# Altium project Trepanat.PrjPcb
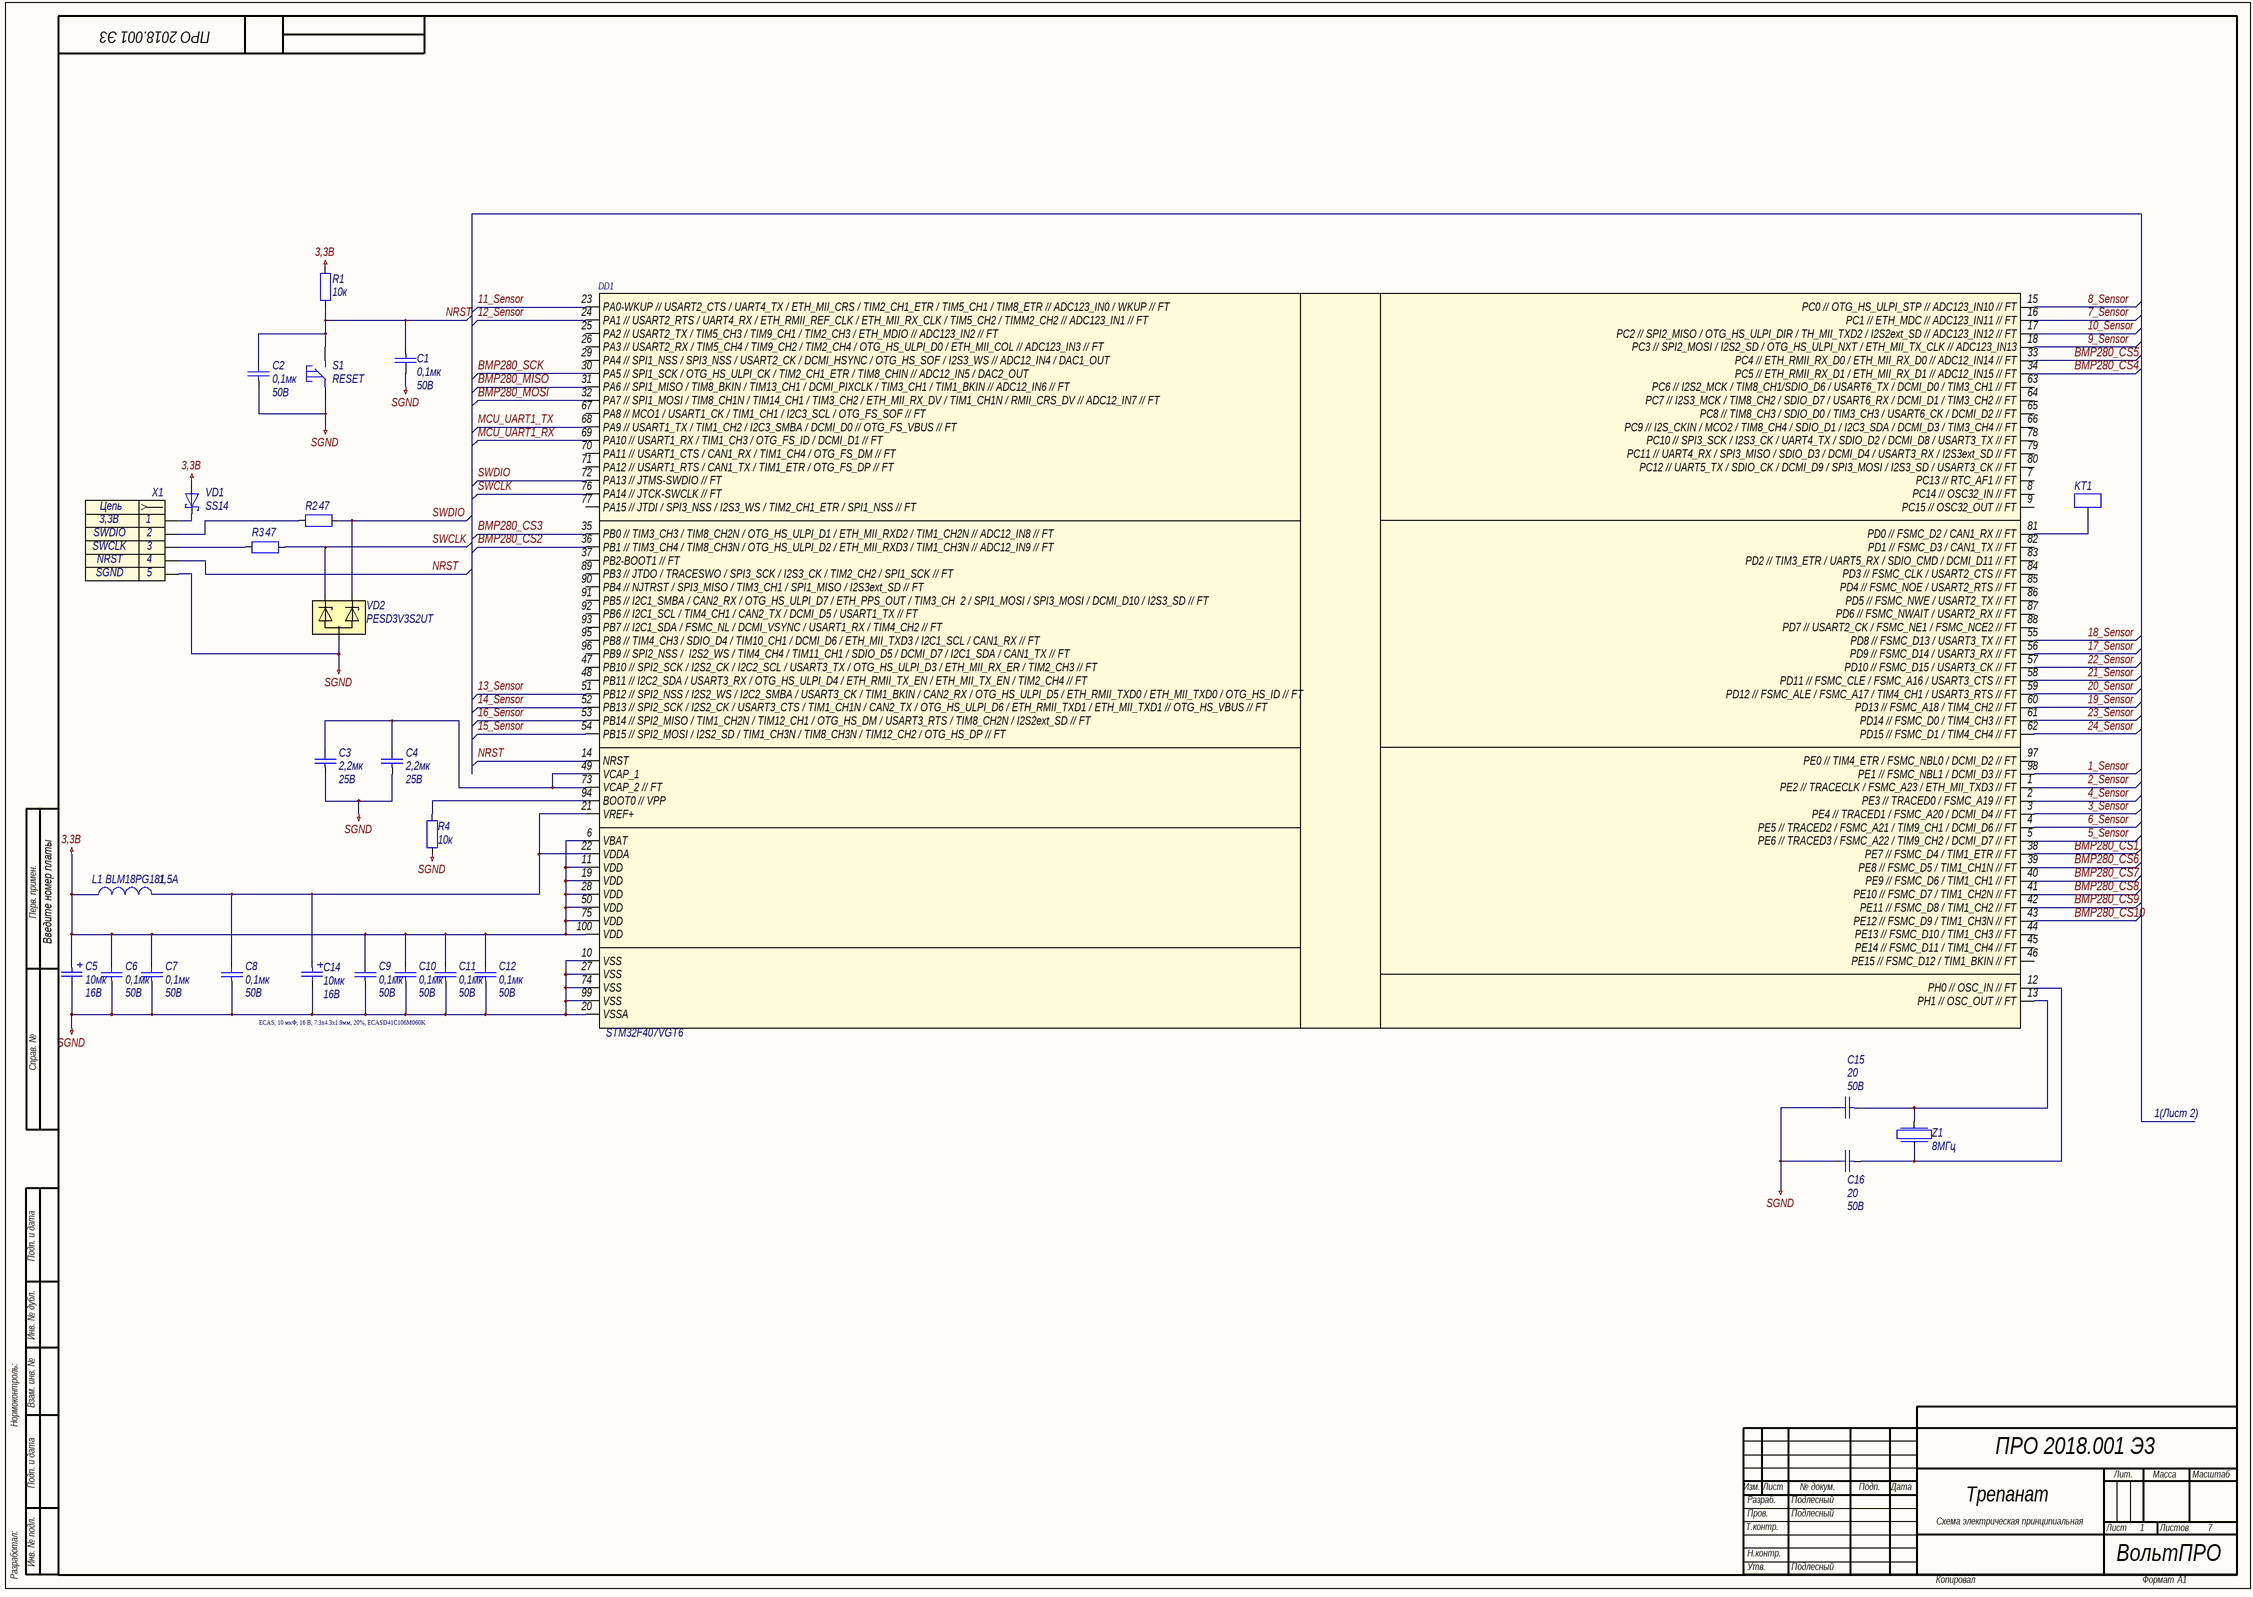
[diagram p0: Trepanat_MCU.SchDoc]
7 sheets, 354 parts. Net scope: global (net labels, ports and power ports of the same name join across sheets).
Board file: Trepanat.PcbDoc
Sheets:
  Trepanat_MCU.SchDoc
  Trepanat_Output.SchDoc
  Trepanat_Power.SchDoc
  Trepanat_Pressure.SchDoc
  Trepanat_Sensors_1.SchDoc
  Trepanat_Sensors_2.SchDoc
  Trepanat_Sensors_3.SchDoc

## Sheet Trepanat_MCU.SchDoc: Трепанат
size 840 x 594 mm; ApprovedBy: Подлесный; CheckedBy: Подлесный; CompanyName: ВольтПРО; DrawnBy: Подлесный; DocumentNumber: ПРО 2018.001 Э3; SheetNumber: 1; SheetTotal: 7; DocumentType: Схема электрическая принципиальная; Format: A1; ImagePath: Введите номер платы

### Parts
C1  0,1мк  Voltage: 50В  [C0805]
C2  0,1мк  Voltage: 50В  [C0805]
C3  2,2мк  Voltage: 25В  [C0805]
C4  2,2мк  Voltage: 25В  [C0805]
C5  Voltage: 16В  [TANTAL CASE D]  (hidden comment: 10мк)
C6  0,1мк  Voltage: 50В  [C0805]
C7  0,1мк  Voltage: 50В  [C0805]
C8  0,1мк  Voltage: 50В  [C0805]
C9  0,1мк  Voltage: 50В  [C0805]
C10  0,1мк  Voltage: 50В  [C0805]
C11  0,1мк  Voltage: 50В  [C0805]
C12  0,1мк  Voltage: 50В  [C0805]
C14  Voltage: 16В  [TANTAL CASE D]  (hidden comment: 10мк)
C15  20  Voltage: 50В  [C0805]
C16  Voltage: 50В  [C0805]  (hidden comment: 20)
DD1  (no value)  [LQPF100]
KT1  KT  [КТ]  (value not drawn)
L1  BLM18PG181  Imax: 1,5A  [L0603]
R1  10к  [R0805]
R2  47  [R0805]
R3  47  [R0805]
R4  10к  [R0805]
S1  RESET  [Button_SMD]
VD1  SS14  [SMA]
VD2  PESD3V3S2UT  [SOT23-3]
X1  (no value)  [PLS-5]
Z1  8МГц  [QSMD5.0x3.2x1.0]

### Nets
3,3B: C5.1 C6.2 C7.2 C9.2 C10.2 C11.2 C12.2 DD1.6(VBAT) DD1.11(VDD) DD1.19(VDD) DD1.28(VDD) DD1.50(VDD) DD1.75(VDD) DD1.100(VDD) L1.1 R1.2 VD1.2(A)
SGND: C1.2 C2.1 C3.1 C4.1 C5.2 C6.1 C7.1 C8.1 C9.1 C10.1 C11.1 C12.1 C14.2 C15.2 C16.2 DD1.10(VSS) DD1.20(VSSA) DD1.27(VSS) DD1.74(VSS) DD1.99(VSS) R4.2 S1.1 VD2.3 X1.5
1_Sensor: DD1.98(PE1_//_FSMC_NBL1_/_DCMI_D3_//_FT)
2_Sensor: DD1.1(PE2_//_TRACECLK_/_FSMC_A23_/_ETH_MII_TXD3_//_FT)
3_Sensor: DD1.3(PE4_//_TRACED1_/_FSMC_A20_/_DCMI_D4_//_FT)
4_Sensor: DD1.2(PE3_//_TRACED0_/_FSMC_A19_//_FT)
5_Sensor: DD1.5(PE6_//_TRACED3_/_FSMC_A22_/_TIM9_CH2_/_DCMI_D7_//_FT)
6_Sensor: DD1.4(PE5_//_TRACED2_/_FSMC_A21_/_TIM9_CH1_/_DCMI_D6_//_FT)
7_Sensor: DD1.16(PC1_//_ETH_MDC_//_ADC123_IN11_//_FT)
8_Sensor: DD1.15(PC0_//_OTG_HS_ULPI_STP_//_ADC123_IN10_//_FT)
9_Sensor: DD1.18(PC3_//_SPI2_MOSI_/_I2S2_SD_/_OTG_HS_ULPI_NXT_/_ETH_MII_TX_CLK_//_ADC123_IN13)
10_Sensor: DD1.17(PC2_//_SPI2_MISO_/_OTG_HS_ULPI_DIR_/_TH_MII_TXD2_/_I2S2ext_SD_//_ADC123_IN12_//_FT)
11_Sensor: DD1.23(PA0-WKUP_//_USART2_CTS_/_UART4_TX_/_ETH_MII_CRS_/_TIM2_CH1_ETR_/_TIM5_CH1_/_TIM8_ETR_//_ADC123_IN0_/_WKUP_//_FT)
12_Sensor: DD1.24(PA1_//_USART2_RTS_/_UART4_RX_/_ETH_RMII_REF_CLK_/_ETH_MII_RX_CLK_/_TIM5_CH2_/_TIMM2_CH2_//_ADC123_IN1_//_FT)
13_Sensor: DD1.51(PB12_//_SPI2_NSS_/_I2S2_WS_/_I2C2_SMBA_/_USART3_CK_/_TIM1_BKIN_/_CAN2_RX_/_OTG_HS_ULPI_D5_/_ETH_RMII_TXD0_/_ETH_MII_TXD0_/_OTG_HS_ID_//_FT)
14_Sensor: DD1.52(PB13_//_SPI2_SCK_/_I2S2_CK_/_USART3_CTS_/_TIM1_CH1N_/_CAN2_TX_/_OTG_HS_ULPI_D6_/_ETH_RMII_TXD1_/_ETH_MII_TXD1_//_OTG_HS_VBUS_//_FT)
15_Sensor: DD1.54(PB15_//_SPI2_MOSI_/_I2S2_SD_/_TIM1_CH3N_/_TIM8_CH3N_/_TIM12_CH2_/_OTG_HS_DP_//_FT)
16_Sensor: DD1.53(PB14_//_SPI2_MISO_/_TIM1_CH2N_/_TIM12_CH1_/_OTG_HS_DM_/_USART3_RTS_/_TIM8_CH2N_/_I2S2ext_SD_//_FT)
17_Sensor: DD1.56(PD9_//_FSMC_D14_/_USART3_RX_//_FT)
18_Sensor: DD1.55(PD8_//_FSMC_D13_/_USART3_TX_//_FT)
19_Sensor: DD1.60(PD13_//_FSMC_A18_/_TIM4_CH2_//_FT)
20_Sensor: DD1.59(PD12_//_FSMC_ALE_/_FSMC_A17_/_TIM4_CH1_/_USART3_RTS_//_FT)
21_Sensor: DD1.58(PD11_//_FSMC_CLE_/_FSMC_A16_/_USART3_CTS_//_FT)
22_Sensor: DD1.57(PD10_//_FSMC_D15_/_USART3_CK_//_FT)
23_Sensor: DD1.61(PD14_//_FSMC_D0_/_TIM4_CH3_//_FT)
24_Sensor: DD1.62(PD15_//_FSMC_D1_/_TIM4_CH4_//_FT)
BMP280_CS1: DD1.38(PE7_//_FSMC_D4_/_TIM1_ETR_//_FT)
BMP280_CS2: DD1.36(PB1_//_TIM3_CH4_/_TIM8_CH3N_/_OTG_HS_ULPI_D2_/_ETH_MII_RXD3_/_TIM1_CH3N_//_ADC12_IN9_//_FT)
BMP280_CS3: DD1.35(PB0_//_TIM3_CH3_/_TIM8_CH2N_/_OTG_HS_ULPI_D1_/_ETH_MII_RXD2_/_TIM1_CH2N_//_ADC12_IN8_//_FT)
BMP280_CS4: DD1.34(PC5_//_ETH_RMII_RX_D1_/_ETH_MII_RX_D1_//_ADC12_IN15_//_FT)
BMP280_CS5: DD1.33(PC4_//_ETH_RMII_RX_D0_/_ETH_MII_RX_D0_//_ADC12_IN14_//_FT)
BMP280_CS6: DD1.39(PE8_//_FSMC_D5_/_TIM1_CH1N_//_FT)
BMP280_CS7: DD1.40(PE9_//_FSMC_D6_/_TIM1_CH1_//_FT)
BMP280_CS8: DD1.41(PE10_//_FSMC_D7_/_TIM1_CH2N_//_FT)
BMP280_CS9: DD1.42(PE11_//_FSMC_D8_/_TIM1_CH2_//_FT)
BMP280_CS10: DD1.43(PE12_//_FSMC_D9_/_TIM1_CH3N_//_FT)
BMP280_MISO: DD1.31(PA6_//_SPI1_MISO_/_TIM8_BKIN_/_TIM13_CH1_/_DCMI_PIXCLK_/_TIM3_CH1_/_TIM1_BKIN_//_ADC12_IN6_//_FT)
BMP280_MOSI: DD1.32(PA7_//_SPI1_MOSI_/_TIM8_CH1N_/_TIM14_CH1_/_TIM3_CH2_/_ETH_MII_RX_DV_/_TIM1_CH1N_/_RMII_CRS_DV_//_ADC12_IN7_//_FT)
BMP280_SCK: DD1.30(PA5_//_SPI1_SCK_/_OTG_HS_ULPI_CK_/_TIM2_CH1_ETR_/_TIM8_CHIN_//_ADC12_IN5_/_DAC2_OUT)
MCU_UART1_RX: DD1.69(PA10_//_USART1_RX_/_TIM1_CH3_/_OTG_FS_ID_/_DCMI_D1_//_FT)
MCU_UART1_TX: DD1.68(PA9_//_USART1_TX_/_TIM1_CH2_/_I2C3_SMBA_/_DCMI_D0_//_OTG_FS_VBUS_//_FT)
NRST: C1.1 C2.2 DD1.14(NRST) R1.1 S1.4 X1.4
SWCLK: DD1.76(PA14_//_JTCK-SWCLK_//_FT) R3.1 VD2.1
SWDIO: DD1.72(PA13_//_JTMS-SWDIO_//_FT) R2.1 VD2.2
NetC3_2: C3.2 C4.2 DD1.49(VCAP_1) DD1.73(VCAP_2_//_FT)
NetC8_2: C8.2 C14.1 DD1.21(VREF+) DD1.22(VDDA) L1.2
NetC15_1: C15.1 DD1.13(PH1_//_OSC_OUT_//_FT) Z1.2
NetC16_1: C16.1 DD1.12(PH0_//_OSC_IN_//_FT) Z1.1
NetDD1_81: DD1.81(PD0_//_FSMC_D2_/_CAN1_RX_//_FT) KT1.1
NetDD1_94: DD1.94(BOOT0_//_VPP) R4.1
NetR2_2: R2.2 X1.2
NetR3_2: R3.2 X1.3
NetVD1_1: VD1.1(K) X1.1

Not connected (* = marked no-connect by the designer): DD1 7(PC13_//_RTC_AF1_//_FT) 8(PC14_//_OSC32_IN_//_FT) 9(PC15_//_OSC32_OUT_//_FT) 25(PA2_//_USART2_TX_/_TIM5_CH3_/_TIM9_CH1_/_TIM2_CH3_/_ETH_MDIO_//_ADC123_IN2_//_FT) 26(PA3_//_USART2_RX_/_TIM5_CH4_/_TIM9_CH2_/_TIM2_CH4_/_OTG_HS_ULPI_D0_/_ETH_MII_COL_//_ADC123_IN3_//_FT) 29(PA4_//_SPI1_NSS_/_SPI3_NSS_/_USART2_CK_/_DCMI_HSYNC_/_OTG_HS_SOF_/_I2S3_WS_//_ADC12_IN4_/_DAC1_OUT) 37(PB2-BOOT1_//_FT) 44(PE13_//_FSMC_D10_/_TIM1_CH3_//_FT) 45(PE14_//_FSMC_D11_/_TIM1_CH4_//_FT) 46(PE15_//_FSMC_D12_/_TIM1_BKIN_//_FT) 47(PB10_//_SPI2_SCK_/_I2S2_CK_/_I2C2_SCL_/_USART3_TX_/_OTG_HS_ULPI_D3_/_ETH_MII_RX_ER_/_TIM2_CH3_//_FT) 48(PB11_//_I2C2_SDA_/_USART3_RX_/_OTG_HS_ULPI_D4_/_ETH_RMII_TX_EN_/_ETH_MII_TX_EN_/_TIM2_CH4_//_FT) 63(PC6_//_I2S2_MCK_/_TIM8_CH1/SDIO_D6_/_USART6_TX_/_DCMI_D0_/_TIM3_CH1_//_FT) 64(PC7_//_I2S3_MCK_/_TIM8_CH2_/_SDIO_D7_/_USART6_RX_/_DCMI_D1_/_TIM3_CH2_//_FT) 65(PC8_//_TIM8_CH3_/_SDIO_D0_/_TIM3_CH3_/_USART6_CK_/_DCMI_D2_//_FT) 66(PC9_//_I2S_CKIN_/_MCO2_/_TIM8_CH4_/_SDIO_D1_/_I2C3_SDA_/_DCMI_D3_/_TIM3_CH4_//_FT) 67(PA8_//_MCO1_/_USART1_CK_/_TIM1_CH1_/_I2C3_SCL_/_OTG_FS_SOF_//_FT) 70(PA11_//_USART1_CTS_/_CAN1_RX_/_TIM1_CH4_/_OTG_FS_DM_//_FT) 71(PA12_//_USART1_RTS_/_CAN1_TX_/_TIM1_ETR_/_OTG_FS_DP_//_FT) 77(PA15_//_JTDI_/_SPI3_NSS_/_I2S3_WS_/_TIM2_CH1_ETR_/_SPI1_NSS_//_FT) 78(PC10_//_SPI3_SCK_/_I2S3_CK_/_UART4_TX_/_SDIO_D2_/_DCMI_D8_/_USART3_TX_//_FT) 79(PC11_//_UART4_RX_/_SPI3_MISO_/_SDIO_D3_/_DCMI_D4_/_USART3_RX_/_I2S3ext_SD_//_FT) 80(PC12_//_UART5_TX_/_SDIO_CK_/_DCMI_D9_/_SPI3_MOSI_/_I2S3_SD_/_USART3_CK_//_FT) 82(PD1_//_FSMC_D3_/_CAN1_TX_//_FT) 83(PD2_//_TIM3_ETR_/_UART5_RX_/_SDIO_CMD_/_DCMI_D11_//_FT) 84(PD3_//_FSMC_CLK_/_USART2_CTS_//_FT) 85(PD4_//_FSMC_NOE_/_USART2_RTS_//_FT) 86(PD5_//_FSMC_NWE_/_USART2_TX_//_FT) 87(PD6_//_FSMC_NWAIT_/_USART2_RX_//_FT) 88(PD7_//_USART2_CK_/_FSMC_NE1_/_FSMC_NCE2_//_FT) 89(PB3_//_JTDO_/_TRACESWO_/_SPI3_SCK_/_I2S3_CK_/_TIM2_CH2_/_SPI1_SCK_//_FT) 90(PB4_//_NJTRST_/_SPI3_MISO_/_TIM3_CH1_/_SPI1_MISO_/_I2S3ext_SD_//_FT) 91(PB5_//_I2C1_SMBA_/_CAN2_RX_/_OTG_HS_ULPI_D7_/_ETH_PPS_OUT_/_TIM3_CH__2_/_SPI1_MOSI_/_SPI3_MOSI_/_DCMI_D10_/_I2S3_SD_//_FT) 92(PB6_//_I2C1_SCL_/_TIM4_CH1_/_CAN2_TX_/_DCMI_D5_/_USART1_TX_//_FT) 93(PB7_//_I2C1_SDA_/_FSMC_NL_/_DCMI_VSYNC_/_USART1_RX_/_TIM4_CH2_//_FT) 95(PB8_//_TIM4_CH3_/_SDIO_D4_/_TIM10_CH1_/_DCMI_D6_/_ETH_MII_TXD3_/_I2C1_SCL_/_CAN1_RX_//_FT) 96(PB9_//_SPI2_NSS_/__I2S2_WS_/_TIM4_CH4_/_TIM11_CH1_/_SDIO_D5_/_DCMI_D7_/_I2C1_SDA_/_CAN1_TX_//_FT) 97(PE0_//_TIM4_ETR_/_FSMC_NBL0_/_DCMI_D2_//_FT)

### Notes on the sheet
- Перв. примен.
- ECAS, 10 мкФ, 16 В, 7.3х4.3х1.9мм, 20%, ECASD41C106M060K
- Справ. №
- 1(Лист 2)
- Подп. и дата
- Инв. № дубл.
- Нормоконтроль:
- Взам. инв. №
- Изм.
- Лист
- № докум.
- Подп.
- Дата
- Лит.
- Масса
- Масштаб
- Т.контр.
- Пров.
- Разраб.
- Листов
- Разработал:
- Инв. № подл.
- Н.контр.
- ВольтПРО
- Утв.
- Копировал
- Формат
- (in symbol Header_5_sct) Цепь

### Library data of the parts
C1-C4 C6-C12 C15 C16 = Capacitor: Конденсатор
  C1 C2 C6-C12: Value: 0,1мк
  C3 C4: Value: 2,2мк
  C15 C16: Value: 20
C5 C14 = Capacitor_pol: Конденсатор полярный; Value: 10мк
DD1 = STM32F407VGT6: Микроконтроллер
KT1 = KT: Контрольная точка
L1 = Inductor: Катушка индуктивности; Value: XXX; Name: BLM18PG181
R1-R4 = Resistor: Резистор
  R1 R4: Value: 10к
  R2 R3: Value: 47
S1 = Button_SMD: Кнопка; Name: RESET
VD1 = DiodeSchottky: Диод Шоттки; Name: SS14
VD2 = PESD3V3S2UT: Сборка TVS-диодов; Name: PESD3V3S2UT
X1 = Header_5_sct: Разъем - 4 конт. розетка; Contact_1: 3,3B; Contact_2: SWDIO; Contact_3: SWCLK; Contact_4: NRST; Contact_5: SGND
Z1 = Crystal: Кварцевый резонатор; Value: 8МГц

## Sheet Trepanat_Output.SchDoc
size 594 x 420 mm; DocumentNumber: ПРО 2018.001 Э3; SheetNumber: 2; Format: A2
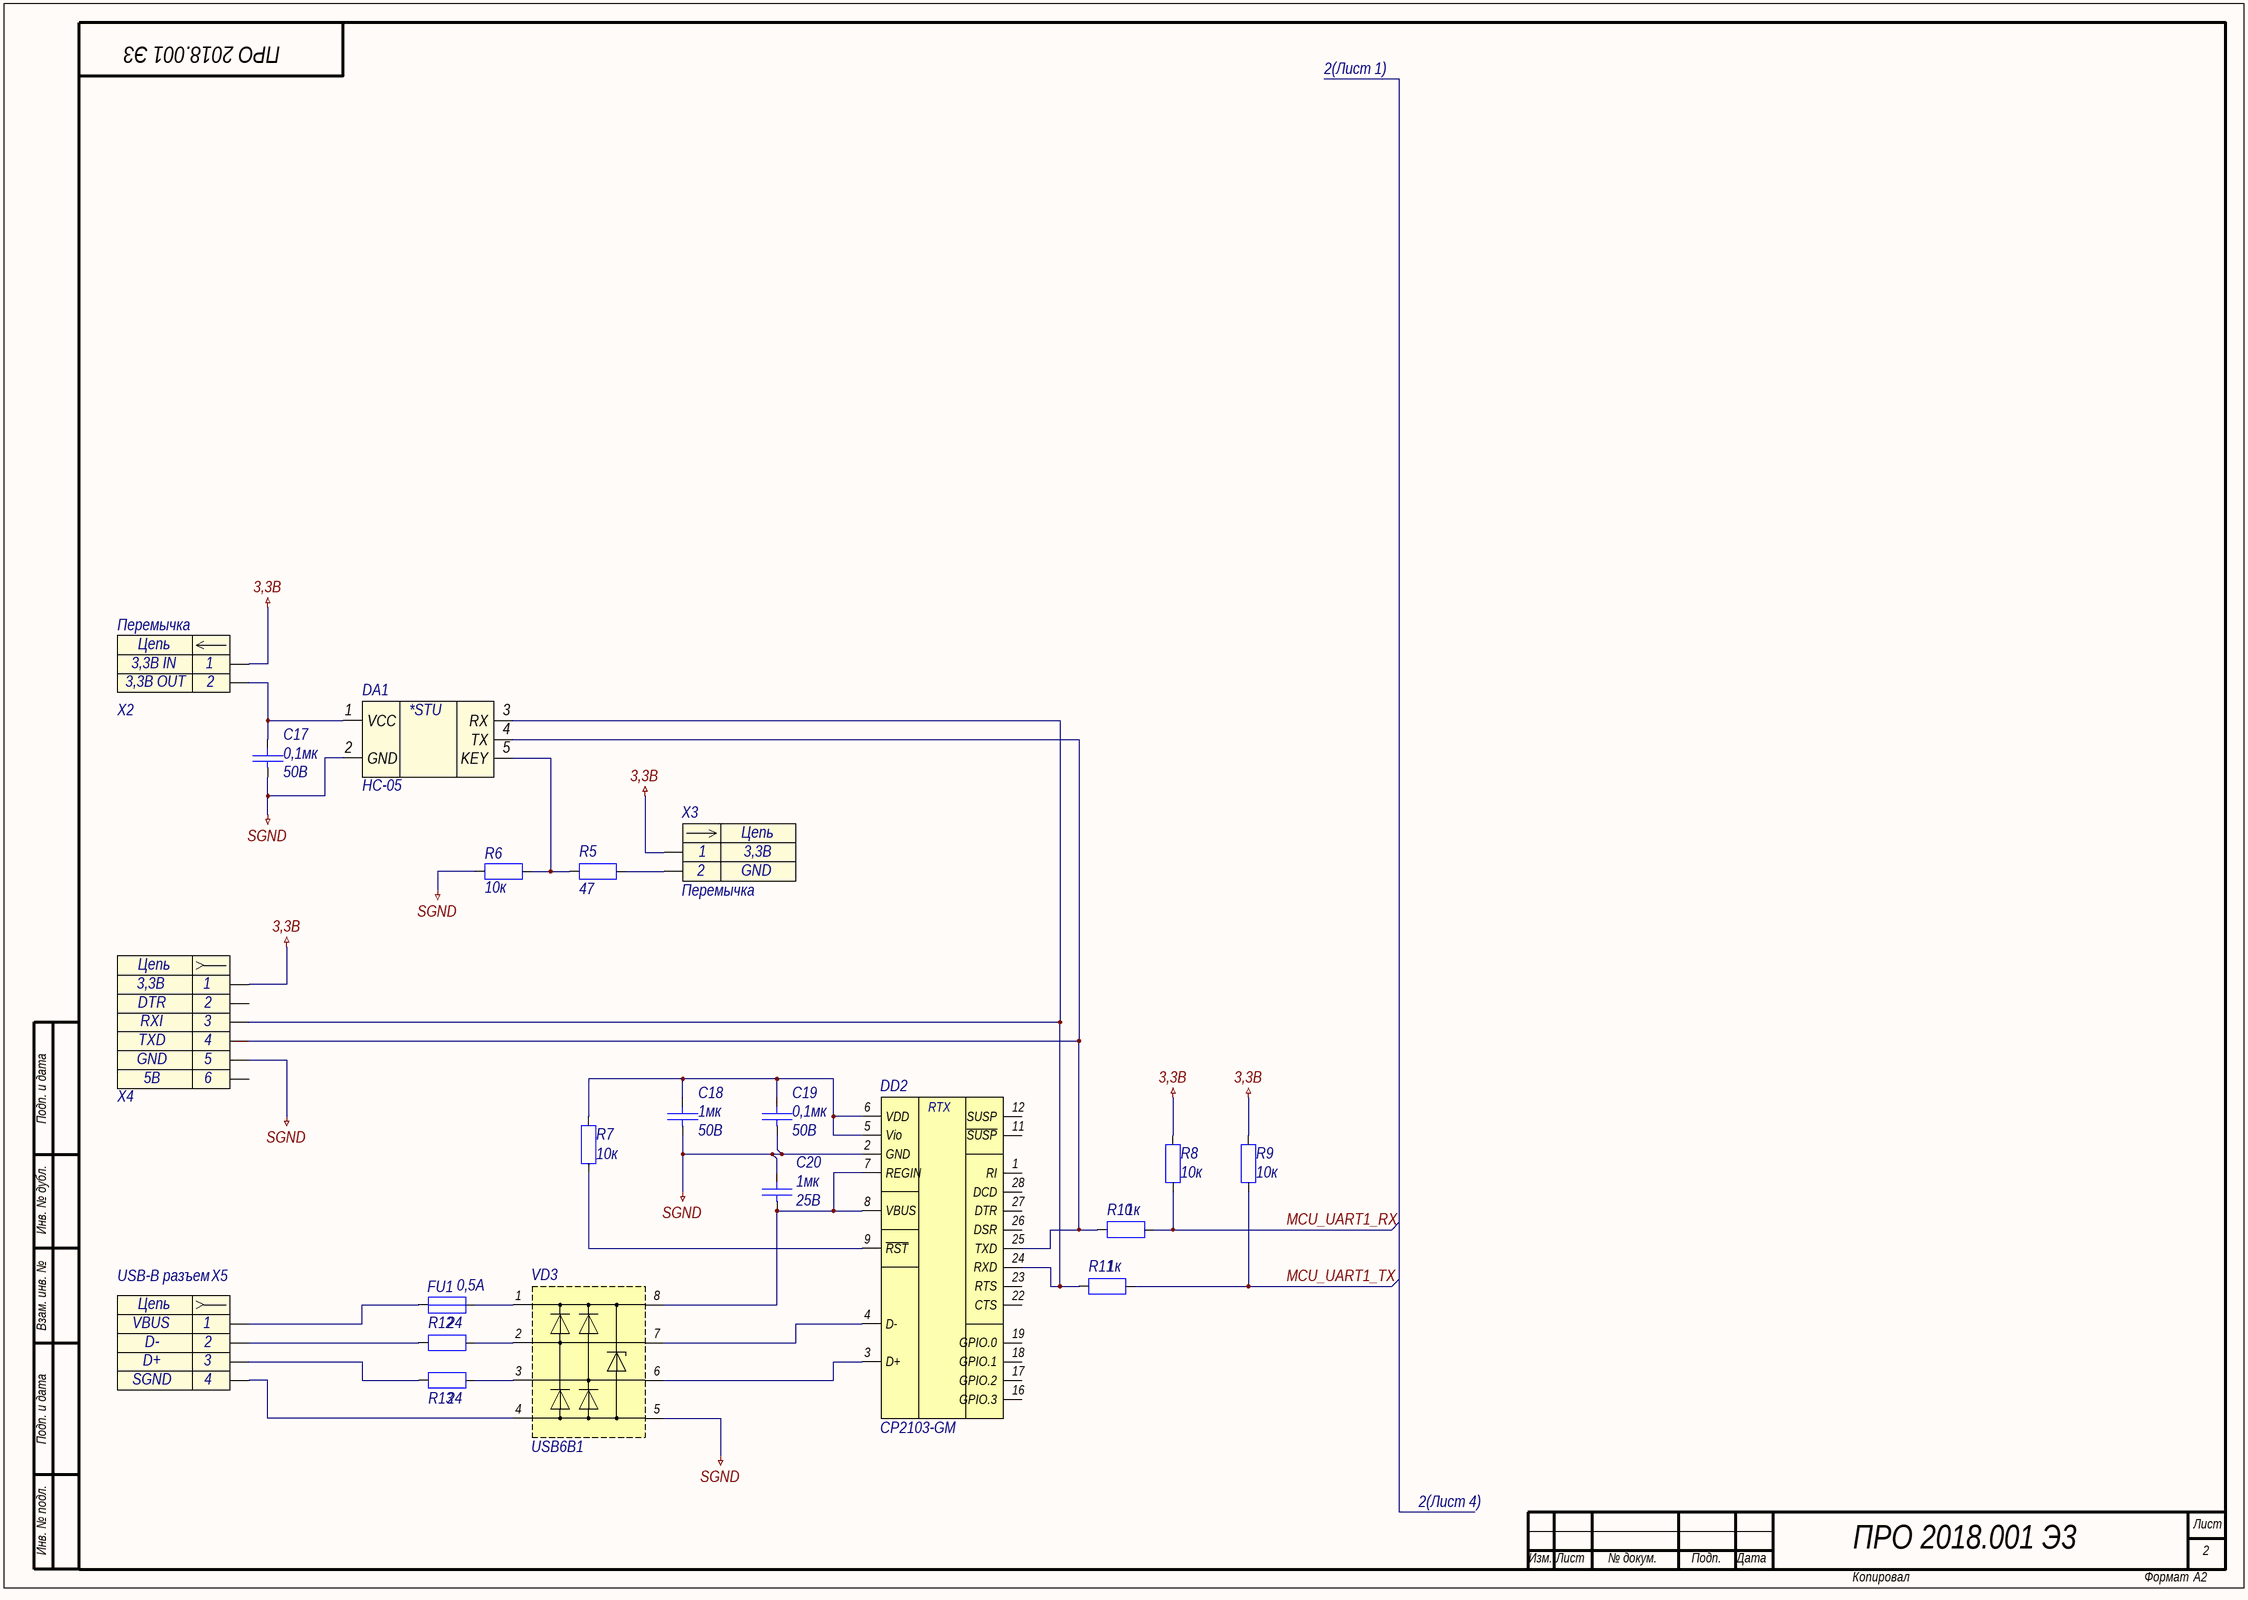
[diagram p1: Trepanat_Output.SchDoc]

### Parts
C17  0,1мк  Voltage: 50В  [C0805]
C18  1мк  Voltage: 50В  [C0805]
C19  0,1мк  Voltage: 50В  [C0805]
C20  1мк  Voltage: 25В  [C0805]
DA1  HC-05  [HC-05]
DD2  CP2103-GM  [QFN28]
FU1  value 0,5A  [R1812]  (hidden comment: MF-MSMF050)
R5  47  [R0805]
R6  10к  [R0805]
R7  10к  [R0805]
R8  10к  [R0805]
R9  10к  [R0805]
R10  1к  [R0805]
R11  1к  [R0805]
R12  24  [R0805]
R13  24  [R0805]
VD3  USB6B1  [SO8]
X2  Перемычка  [PLS2-2]
X3  Перемычка  [PLS2-2]
X4  (no value)  [PLS-6]
X5  670687041  [USBB-J1]  (value not drawn)

### Nets
3,3B: R8.1 R9.1 X2.1 X3.1 X4.1
SGND: C17.1 C18.1 C19.1 C20.2 DA1.2(GND) DD2.2(GND) R6.1 VD3.5 X4.5
MCU_UART1_RX: R8.2 R10.1
MCU_UART1_TX: R9.2 R11.1
NetC17_2: C17.2 DA1.1(VCC) X2.2
NetC18_2: C18.2 C19.2 DD2.5(Vio) DD2.6(VDD) R7.1
NetC20_1: C20.1 DD2.7(REGIN) DD2.8(VBUS) VD3.8
NetDA1_3: DA1.3(RX) DD2.24(RXD) R11.2 X4.3
NetDA1_4: DA1.4(TX) DD2.25(TXD) R10.2 X4.4
NetDA1_5: DA1.5(KEY) R5.2 R6.2
NetDD2_3: DD2.3(D+) VD3.6
NetDD2_4: DD2.4(D-) VD3.7
NetDD2_9: DD2.9(~{RST}) R7.2
NetFU1_1: FU1.1 X5.1
NetFU1_2: FU1.2 VD3.1
NetR5_1: R5.1 X3.2
NetR12_1: R12.1 X5.2
NetR12_2: R12.2 VD3.2
NetR13_1: R13.1 X5.3
NetR13_2: R13.2 VD3.3
NetVD3_4: VD3.4 X5.4

Not connected (* = marked no-connect by the designer): DD2 1(RI) 11(~{SUSP}) 12(SUSP) 16(GPIO.3) 17(GPIO.2) 18(GPIO.1) 19(GPIO.0) 22(CTS) 23(RTS) 26(DSR) 27(DTR) 28(DCD); X4 2 6

### Notes on the sheet
- 2(Лист 1)
- Подп. и дата
- Инв. № дубл.
- Взам. инв. №
- USB-B разъем
- 2(Лист 4)
- Инв. № подл.
- Лист
- Изм.
- № докум.
- Подп.
- Дата
- Копировал
- Формат
- (in symbol CP2103) RTX
- (in symbol HC-05) *STU
- (in symbol Header_2_plg) Цепь
- (in symbol Header_4_sct) Цепь
- (in symbol Header_6_sct) Цепь

### Library data of the parts
C17-C20 = Capacitor: Конденсатор
  C17 C19: Value: 0,1мк
  C18 C20: Value: 1мк
DA1 = HC-05: Bluetooth HC-05; Name: HC-05
DD2 = CP2103: USB-UART преобразователь; Name: CP2103-GM
FU1 = Fuse: Предохранитель; Name: MF-MSMF050
R5-R13 = Resistor: Резистор
  R5: Value: 47
  R6-R9: Value: 10к
  R10 R11: Value: 1к
  R12 R13: Value: 24
VD3 = USB6B1: Защита линии данных; Name: USB6B1
X2 = Header_2_plg: Разъем - 2 конт. вилка; Contact_1: 3,3В IN; Contact_2: 3,3В OUT; Name: Перемычка
X3 = Header_2_plg: Разъем - 2 конт. вилка; Contact_1: 3,3В; Contact_2: GND; Name: Перемычка
X4 = Header_6_sct: Разъем - 5 конт. розетка; Contact_1: 3,3В; Contact_2: DTR; Contact_3: RXI; Contact_4: TXD; Contact_5: GND; Contact_6: 5B
X5 = Header_4_sct: Разъем - 4 конт. розетка; Contact_1: VBUS; Contact_2: D-; Contact_3: D+; Contact_4: SGND; Name: 670687041

## Sheet Trepanat_Power.SchDoc
size 420 x 297 mm; DocumentNumber: ПРО 2018.001 Э3; SheetNumber: 3; Format: A3
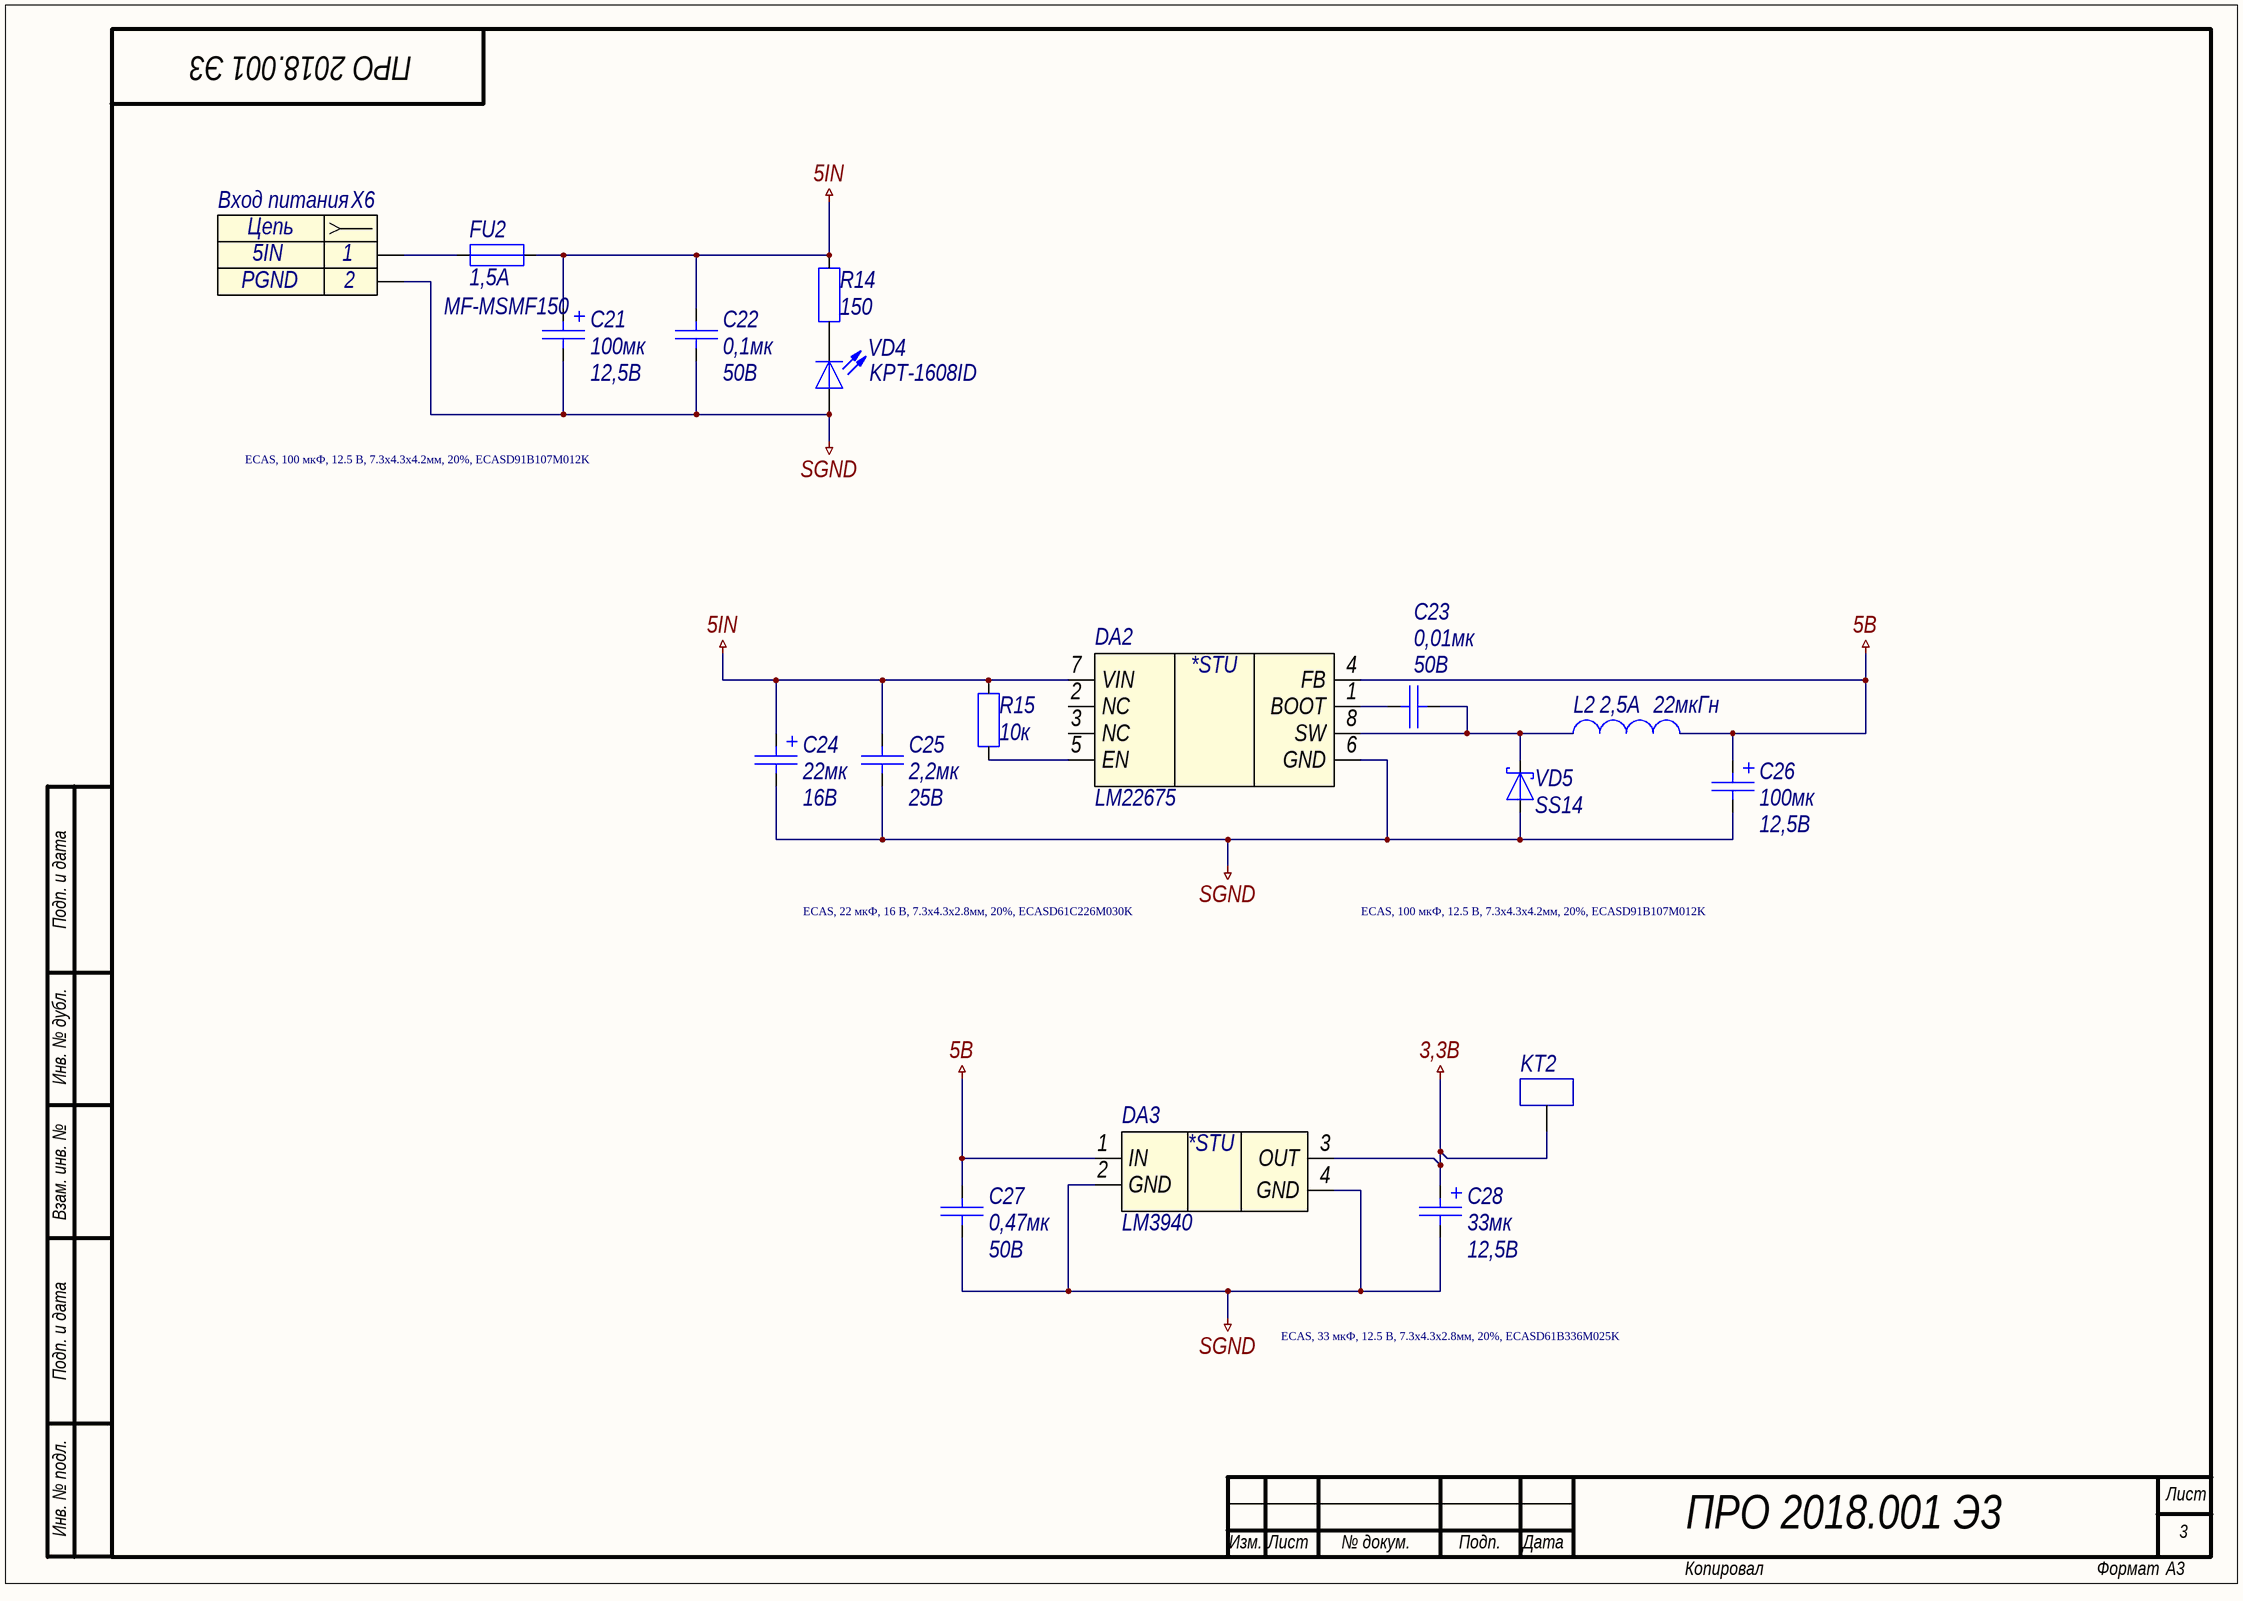
[diagram p2: Trepanat_Power.SchDoc]

### Parts
C21  Voltage: 12,5В  [TANTAL CASE D]  (hidden comment: 100мк)
C22  0,1мк  Voltage: 50В  [C0805]
C23  0,01мк  Voltage: 50В  [C0805]
C24  Voltage: 16В  [TANTAL CASE D]  (hidden comment: 22мк)
C25  2,2мк  Voltage: 25В  [C0805]
C26  Voltage: 12,5В  [TANTAL CASE D]  (hidden comment: 100мк)
C27  0,47мк  Voltage: 50В  [C0805]
C28  Voltage: 12,5В  [TANTAL CASE D]  (hidden comment: 33мк)
DA2  LM22675  [SO PowerPAD-8]
DA3  LM3940  [TO-263-3]
FU2  value 1,5A  [R1812]  (hidden comment: MF-MSMF150)
KT2  KT  [КТ]  (value not drawn)
L2  Imax: 2,5А  [IND_B82464G4223M]  (hidden comment: 22мкГн)
R14  150  [R0805]
R15  10к  [R0805]
VD4  KPT-1608ID  [D0603]
VD5  SS14  [SMA]
X6  Вход питания  [DT-128V-2]

### Nets
3,3B: C28.1 DA3.3(OUT) KT2.1
5B: C26.1 C27.2 DA2.4(FB) DA3.1(IN) L2.2
5IN: C21.1 C22.2 C24.1 C25.2 DA2.7(VIN) FU2.2 R14.1 R15.1
SGND: C21.2 C22.1 C24.2 C25.1 C26.2 C27.1 C28.2 DA2.6(GND) DA3.2(GND) DA3.4(GND) VD4.2(A) VD5.2(A) X6.2
NetC23_1: C23.1 DA2.8(SW) L2.1 VD5.1(K)
NetC23_2: C23.2 DA2.1(BOOT)
NetDA2_5: DA2.5(EN) R15.2
NetFU2_1: FU2.1 X6.1
NetR14_2: R14.2 VD4.1(K)

Not connected (* = marked no-connect by the designer): DA2 2(NC) 3(NC)

### Notes on the sheet
- ECAS, 100 мкФ, 12.5 В, 7.3х4.3х4.2мм, 20%, ECASD91B107M012K
- Подп. и дата
- ECAS, 22 мкФ, 16 В, 7.3х4.3х2.8мм, 20%, ECASD61C226M030K
- Инв. № дубл.
- Взам. инв. №
- ECAS, 33 мкФ, 12.5 В, 7.3х4.3х2.8мм, 20%, ECASD61B336M025K
- Инв. № подл.
- Лист
- Изм.
- № докум.
- Подп.
- Дата
- Копировал
- Формат
- (in symbol Header_2_sct) Цепь
- (in symbol LM3940) *STU
- (in symbol LM22675) *STU

### Library data of the parts
C21 C24 C26 C28 = Capacitor_pol: Конденсатор полярный
  C21 C26: Value: 100мк
  C24: Value: 22мк
  C28: Value: 33мк
C22 C23 C25 C27 = Capacitor: Конденсатор
  C22: Value: 0,1мк
  C23: Value: 0,01мк
  C25: Value: 2,2мк
  C27: Value: 0,47мк
DA2 = LM22675: 3-A Step-Down Voltage Regulator
DA3 = LM3940: Low-Dropout Regulator for 5-V to 3.3-V Conversion
FU2 = Fuse: Предохранитель; Name: MF-MSMF150
KT2 = KT: Контрольная точка
L2 = Inductor: Катушка индуктивности; Value: 22мкГн
R14 R15 = Resistor: Резистор
  R14: Value: 150
  R15: Value: 10к
VD4 = LED_L: Светодиод; Name: KPT-1608ID
VD5 = DiodeSchottky: Диод Шоттки; Name: SS14
X6 = Header_2_sct: Разъем - 2 конт. розетка; Contact_1: 5IN; Contact_2: PGND; Name: Вход питания

## Sheet Trepanat_Pressure.SchDoc
size 594 x 420 mm; DocumentNumber: ПРО 2018.001 Э3; SheetNumber: 4; Format: A2
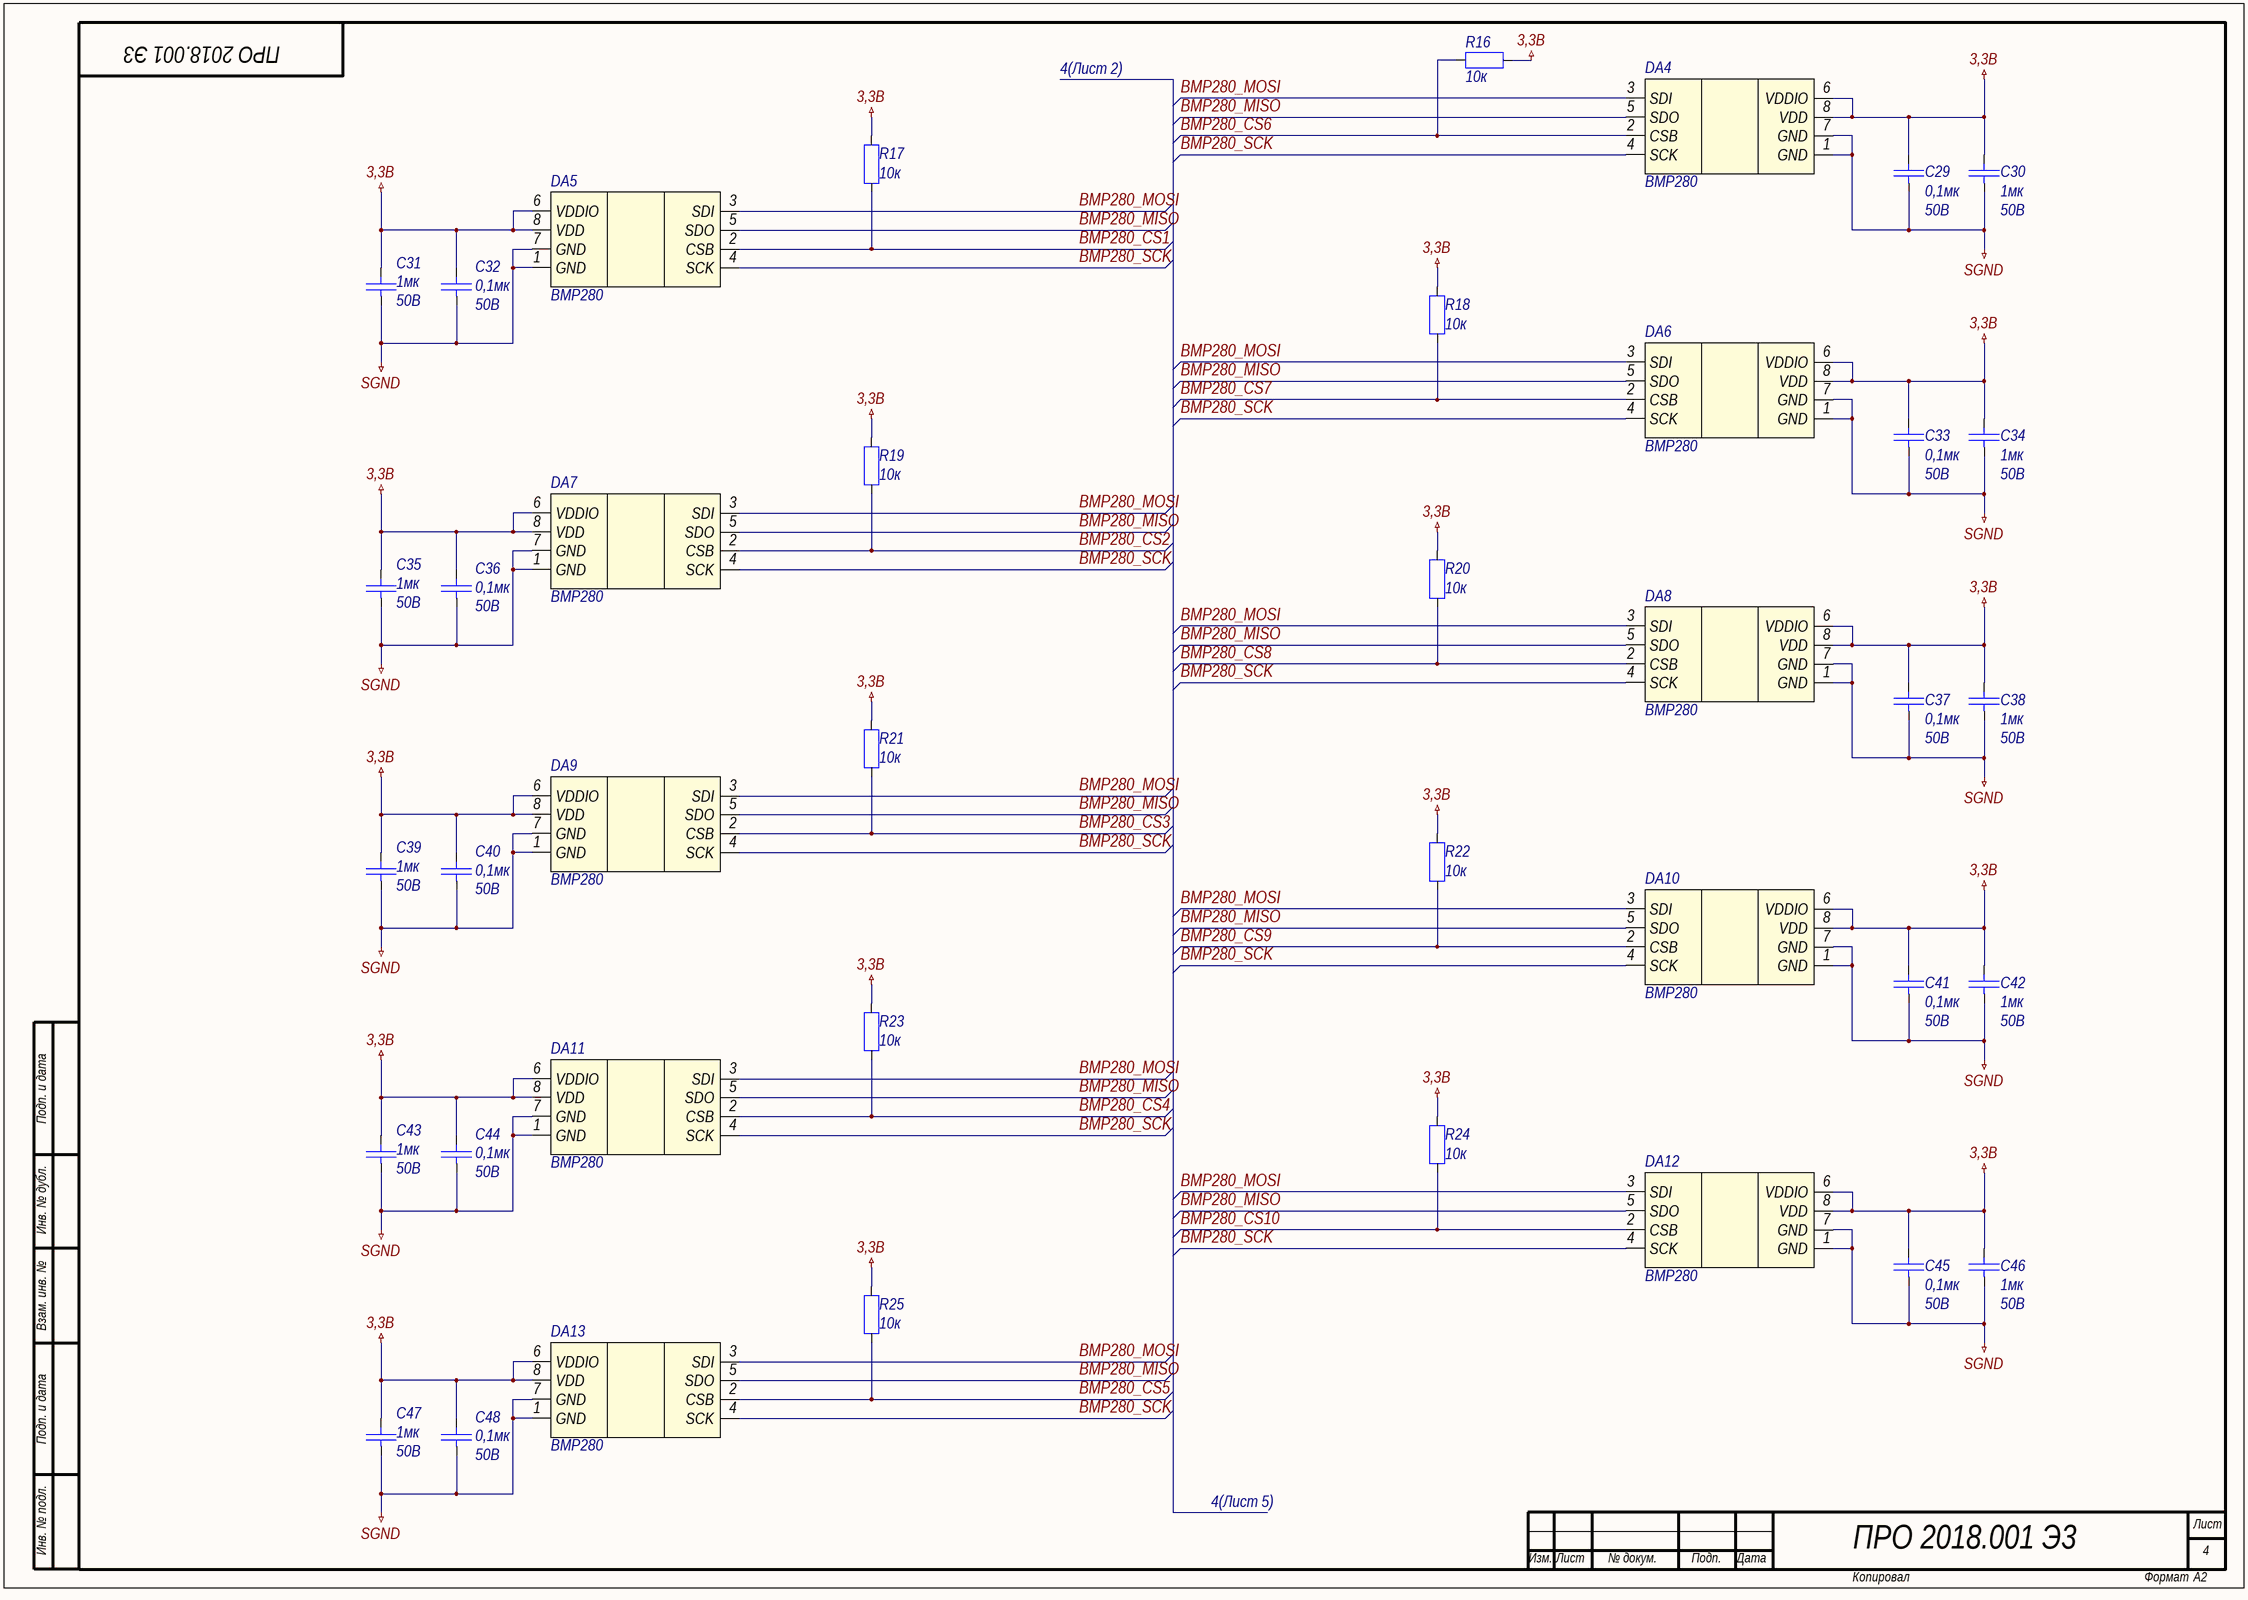
[diagram p3: Trepanat_Pressure.SchDoc]

### Parts
C29  0,1мк  Voltage: 50В  [C0805]
C30  1мк  Voltage: 50В  [C0805]
C31  1мк  Voltage: 50В  [C0805]
C32  0,1мк  Voltage: 50В  [C0805]
C33  0,1мк  Voltage: 50В  [C0805]
C34  1мк  Voltage: 50В  [C0805]
C35  1мк  Voltage: 50В  [C0805]
C36  0,1мк  Voltage: 50В  [C0805]
C37  0,1мк  Voltage: 50В  [C0805]
C38  1мк  Voltage: 50В  [C0805]
C39  1мк  Voltage: 50В  [C0805]
C40  0,1мк  Voltage: 50В  [C0805]
C41  0,1мк  Voltage: 50В  [C0805]
C42  1мк  Voltage: 50В  [C0805]
C43  1мк  Voltage: 50В  [C0805]
C44  0,1мк  Voltage: 50В  [C0805]
C45  0,1мк  Voltage: 50В  [C0805]
C46  1мк  Voltage: 50В  [C0805]
C47  1мк  Voltage: 50В  [C0805]
C48  0,1мк  Voltage: 50В  [C0805]
DA4  BMP280  [BMP280]
DA5  BMP280  [BMP280]
DA6  BMP280  [BMP280]
DA7  BMP280  [BMP280]
DA8  BMP280  [BMP280]
DA9  BMP280  [BMP280]
DA10  BMP280  [BMP280]
DA11  BMP280  [BMP280]
DA12  BMP280  [BMP280]
DA13  BMP280  [BMP280]
R16  10к  [R0805]
R17  10к  [R0805]
R18  10к  [R0805]
R19  10к  [R0805]
R20  10к  [R0805]
R21  10к  [R0805]
R22  10к  [R0805]
R23  10к  [R0805]
R24  10к  [R0805]
R25  10к  [R0805]

### Nets
3,3B: C29.2 C30.2 C31.2 C32.2 C33.2 C34.2 C35.2 C36.2 C37.2 C38.2 C39.2 C40.2 C41.2 C42.2 C43.2 C44.2 C45.2 C46.2 C47.2 C48.2 DA4.6(VDDIO) DA4.8(VDD) DA5.6(VDDIO) DA5.8(VDD) DA6.6(VDDIO) DA6.8(VDD) DA7.6(VDDIO) DA7.8(VDD) DA8.6(VDDIO) DA8.8(VDD) DA9.6(VDDIO) DA9.8(VDD) DA10.6(VDDIO) DA10.8(VDD) DA11.6(VDDIO) DA11.8(VDD) DA12.6(VDDIO) DA12.8(VDD) DA13.6(VDDIO) DA13.8(VDD) R16.1 R17.1 R18.1 R19.1 R20.1 R21.1 R22.1 R23.1 R24.1 R25.1
SGND: C29.1 C30.1 C31.1 C32.1 C33.1 C34.1 C35.1 C36.1 C37.1 C38.1 C39.1 C40.1 C41.1 C42.1 C43.1 C44.1 C45.1 C46.1 C47.1 C48.1 DA4.1(GND) DA4.7(GND) DA5.1(GND) DA5.7(GND) DA6.1(GND) DA6.7(GND) DA7.1(GND) DA7.7(GND) DA8.1(GND) DA8.7(GND) DA9.1(GND) DA9.7(GND) DA10.1(GND) DA10.7(GND) DA11.1(GND) DA11.7(GND) DA12.1(GND) DA12.7(GND) DA13.1(GND) DA13.7(GND)
BMP280_CS1: DA5.2(CSB) R17.2
BMP280_CS2: DA7.2(CSB) R19.2
BMP280_CS3: DA9.2(CSB) R21.2
BMP280_CS4: DA11.2(CSB) R23.2
BMP280_CS5: DA13.2(CSB) R25.2
BMP280_CS6: DA4.2(CSB) R16.2
BMP280_CS7: DA6.2(CSB) R18.2
BMP280_CS8: DA8.2(CSB) R20.2
BMP280_CS9: DA10.2(CSB) R22.2
BMP280_CS10: DA12.2(CSB) R24.2
BMP280_MISO: DA4.5(SDO) DA5.5(SDO) DA6.5(SDO) DA7.5(SDO) DA8.5(SDO) DA9.5(SDO) DA10.5(SDO) DA11.5(SDO) DA12.5(SDO) DA13.5(SDO)
BMP280_MOSI: DA4.3(SDI) DA5.3(SDI) DA6.3(SDI) DA7.3(SDI) DA8.3(SDI) DA9.3(SDI) DA10.3(SDI) DA11.3(SDI) DA12.3(SDI) DA13.3(SDI)
BMP280_SCK: DA4.4(SCK) DA5.4(SCK) DA6.4(SCK) DA7.4(SCK) DA8.4(SCK) DA9.4(SCK) DA10.4(SCK) DA11.4(SCK) DA12.4(SCK) DA13.4(SCK)

### Notes on the sheet
- 4(Лист 2)
- Подп. и дата
- Инв. № дубл.
- Взам. инв. №
- 4(Лист 5)
- Инв. № подл.
- Лист
- Изм.
- № докум.
- Подп.
- Дата
- Копировал
- Формат

### Library data of the parts
C29-C48 = Capacitor: Конденсатор
  C29 C32 C33 C36 C37 C40 C41 C44 C45 C48: Value: 0,1мк
  C30 C31 C34 C35 C38 C39 C42 C43 C46 C47: Value: 1мк
DA4-DA13 = BMP280: BMP280 Barometric Sensor; Name: BMP280
R16-R25 = Resistor: Резистор; Value: 10к

## Sheet Trepanat_Sensors_1.SchDoc
size 594 x 420 mm; DocumentNumber: Введите номер платы + Э3; SheetNumber: номер страницы; Format: A2
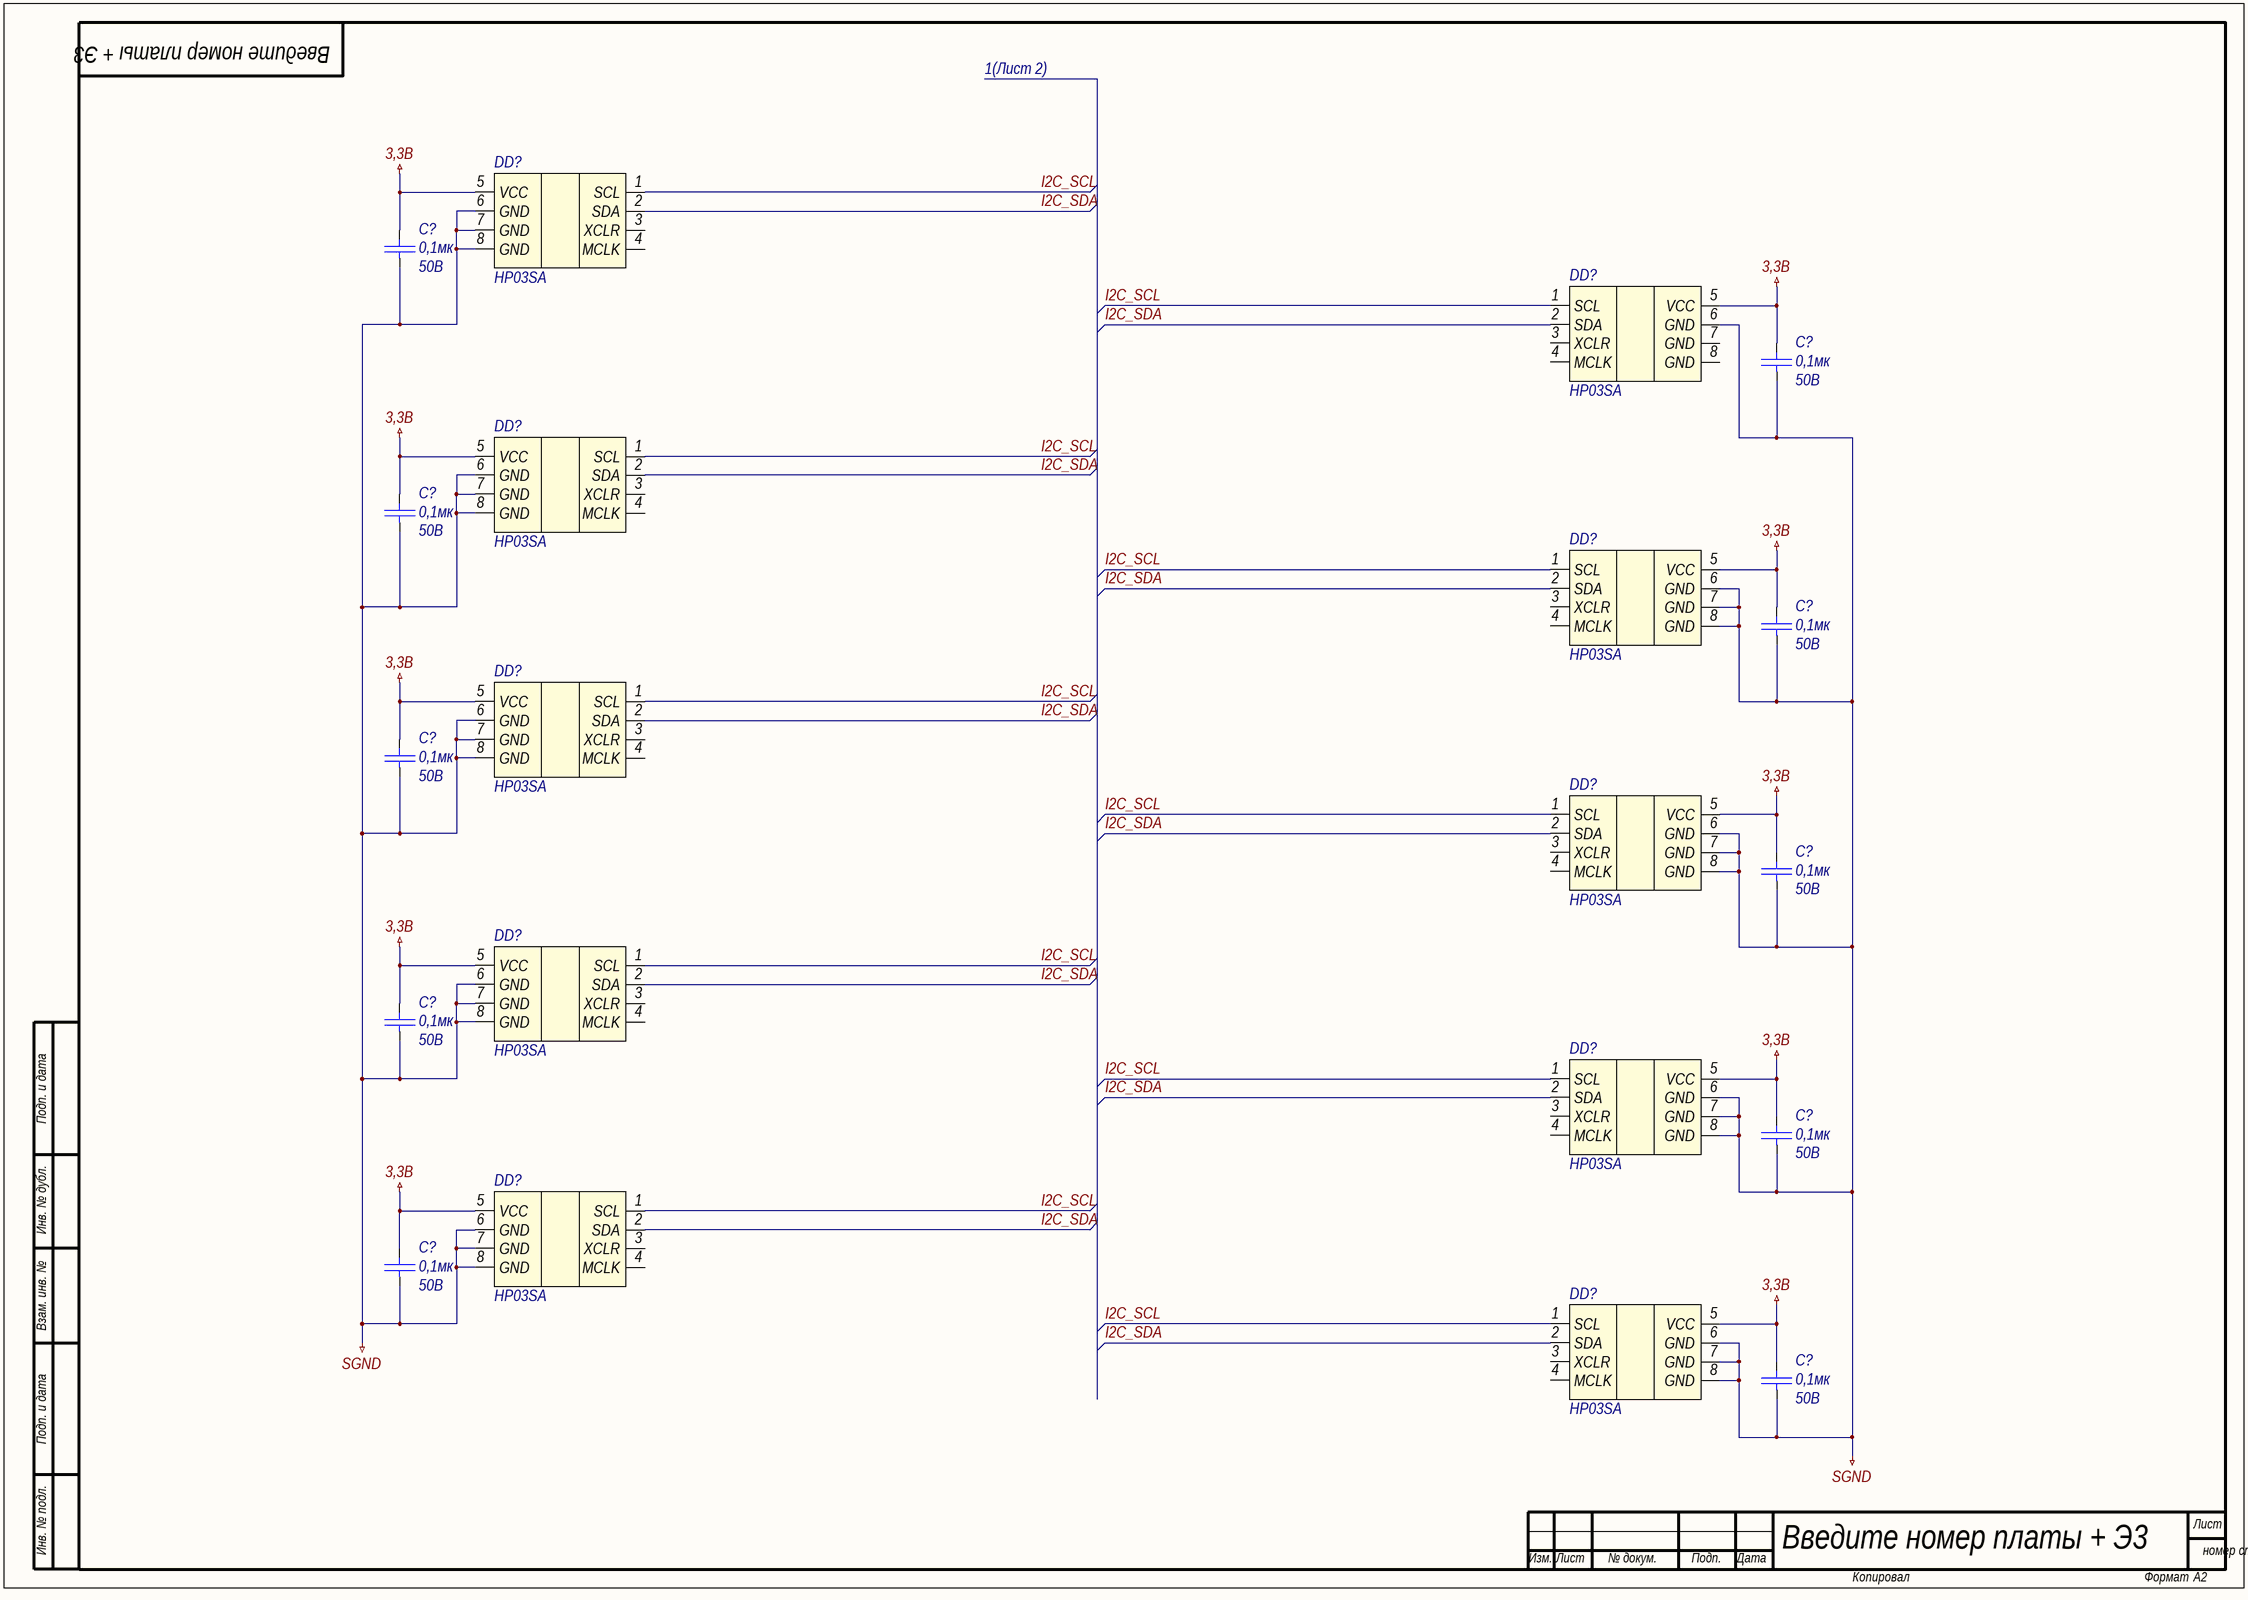
[diagram p4: Trepanat_Sensors_1.SchDoc]

### Parts
(Parts that share a designator on the sheet are numbered #1, #2 ... from top to bottom, then left to right.)
C?#1  0,1мк  Voltage: 50В  [C0805]
C?#2  0,1мк  Voltage: 50В  [C0805]
C?#3  0,1мк  Voltage: 50В  [C0805]
C?#4  0,1мк  Voltage: 50В  [C0805]
C?#5  0,1мк  Voltage: 50В  [C0805]
C?#6  0,1мк  Voltage: 50В  [C0805]
C?#7  0,1мк  Voltage: 50В  [C0805]
C?#8  0,1мк  Voltage: 50В  [C0805]
C?#9  0,1мк  Voltage: 50В  [C0805]
C?#10  0,1мк  Voltage: 50В  [C0805]
DD?#1  HP03SA  [HP03AS]
DD?#2  HP03SA  [HP03AS]
DD?#3  HP03SA  [HP03AS]
DD?#4  HP03SA  [HP03AS]
DD?#5  HP03SA  [HP03AS]
DD?#6  HP03SA  [HP03AS]
DD?#7  HP03SA  [HP03AS]
DD?#8  HP03SA  [HP03AS]
DD?#9  HP03SA  [HP03AS]
DD?#10  HP03SA  [HP03AS]

### Nets
3,3B: C?#1.2 C?#2.2 C?#3.2 C?#4.2 C?#5.2 C?#6.2 C?#7.2 C?#8.2 C?#9.2 C?#10.2 DD?#1.5(VCC) DD?#2.5(VCC) DD?#3.5(VCC) DD?#4.5(VCC) DD?#5.5(VCC) DD?#6.5(VCC) DD?#7.5(VCC) DD?#8.5(VCC) DD?#9.5(VCC) DD?#10.5(VCC)
SGND: C?#1.1 C?#2.1 C?#3.1 C?#4.1 C?#5.1 C?#6.1 C?#7.1 C?#8.1 C?#9.1 C?#10.1 DD?#1.6(GND) DD?#1.7(GND) DD?#1.8(GND) DD?#2.6(GND) DD?#3.6(GND) DD?#3.7(GND) DD?#3.8(GND) DD?#4.6(GND) DD?#4.7(GND) DD?#4.8(GND) DD?#5.6(GND) DD?#5.7(GND) DD?#5.8(GND) DD?#6.6(GND) DD?#6.7(GND) DD?#6.8(GND) DD?#7.6(GND) DD?#7.7(GND) DD?#7.8(GND) DD?#8.6(GND) DD?#8.7(GND) DD?#8.8(GND) DD?#9.6(GND) DD?#9.7(GND) DD?#9.8(GND) DD?#10.6(GND) DD?#10.7(GND) DD?#10.8(GND)
I2C_SCL: DD?#1.1(SCL) DD?#2.1(SCL) DD?#3.1(SCL) DD?#4.1(SCL) DD?#5.1(SCL) DD?#6.1(SCL) DD?#7.1(SCL) DD?#8.1(SCL) DD?#9.1(SCL) DD?#10.1(SCL)
I2C_SDA: DD?#1.2(SDA) DD?#2.2(SDA) DD?#3.2(SDA) DD?#4.2(SDA) DD?#5.2(SDA) DD?#6.2(SDA) DD?#7.2(SDA) DD?#8.2(SDA) DD?#9.2(SDA) DD?#10.2(SDA)

Not connected (* = marked no-connect by the designer): DD?#1 3(XCLR) 4(MCLK); DD?#2 3(XCLR) 4(MCLK) 7(GND) 8(GND); DD?#3 3(XCLR) 4(MCLK); DD?#4 3(XCLR) 4(MCLK); DD?#5 3(XCLR) 4(MCLK); DD?#6 3(XCLR) 4(MCLK); DD?#7 3(XCLR) 4(MCLK); DD?#8 3(XCLR) 4(MCLK); DD?#9 3(XCLR) 4(MCLK); DD?#10 3(XCLR) 4(MCLK)

### Notes on the sheet
- 1(Лист 2)
- Подп. и дата
- Инв. № дубл.
- Взам. инв. №
- Инв. № подл.
- Лист
- Изм.
- № докум.
- Подп.
- Дата
- Копировал
- Формат

### Library data of the parts
C?#1-C?#10 = Capacitor: Конденсатор; Value: 0,1мк
DD?#1-DD?#10 = HP03SA: Pressure module; Name: HP03SA

## Sheet Trepanat_Sensors_2.SchDoc
size 840 x 594 mm; DocumentNumber: ПРО 2018.001 Э3; SheetNumber: 5; Format: A1
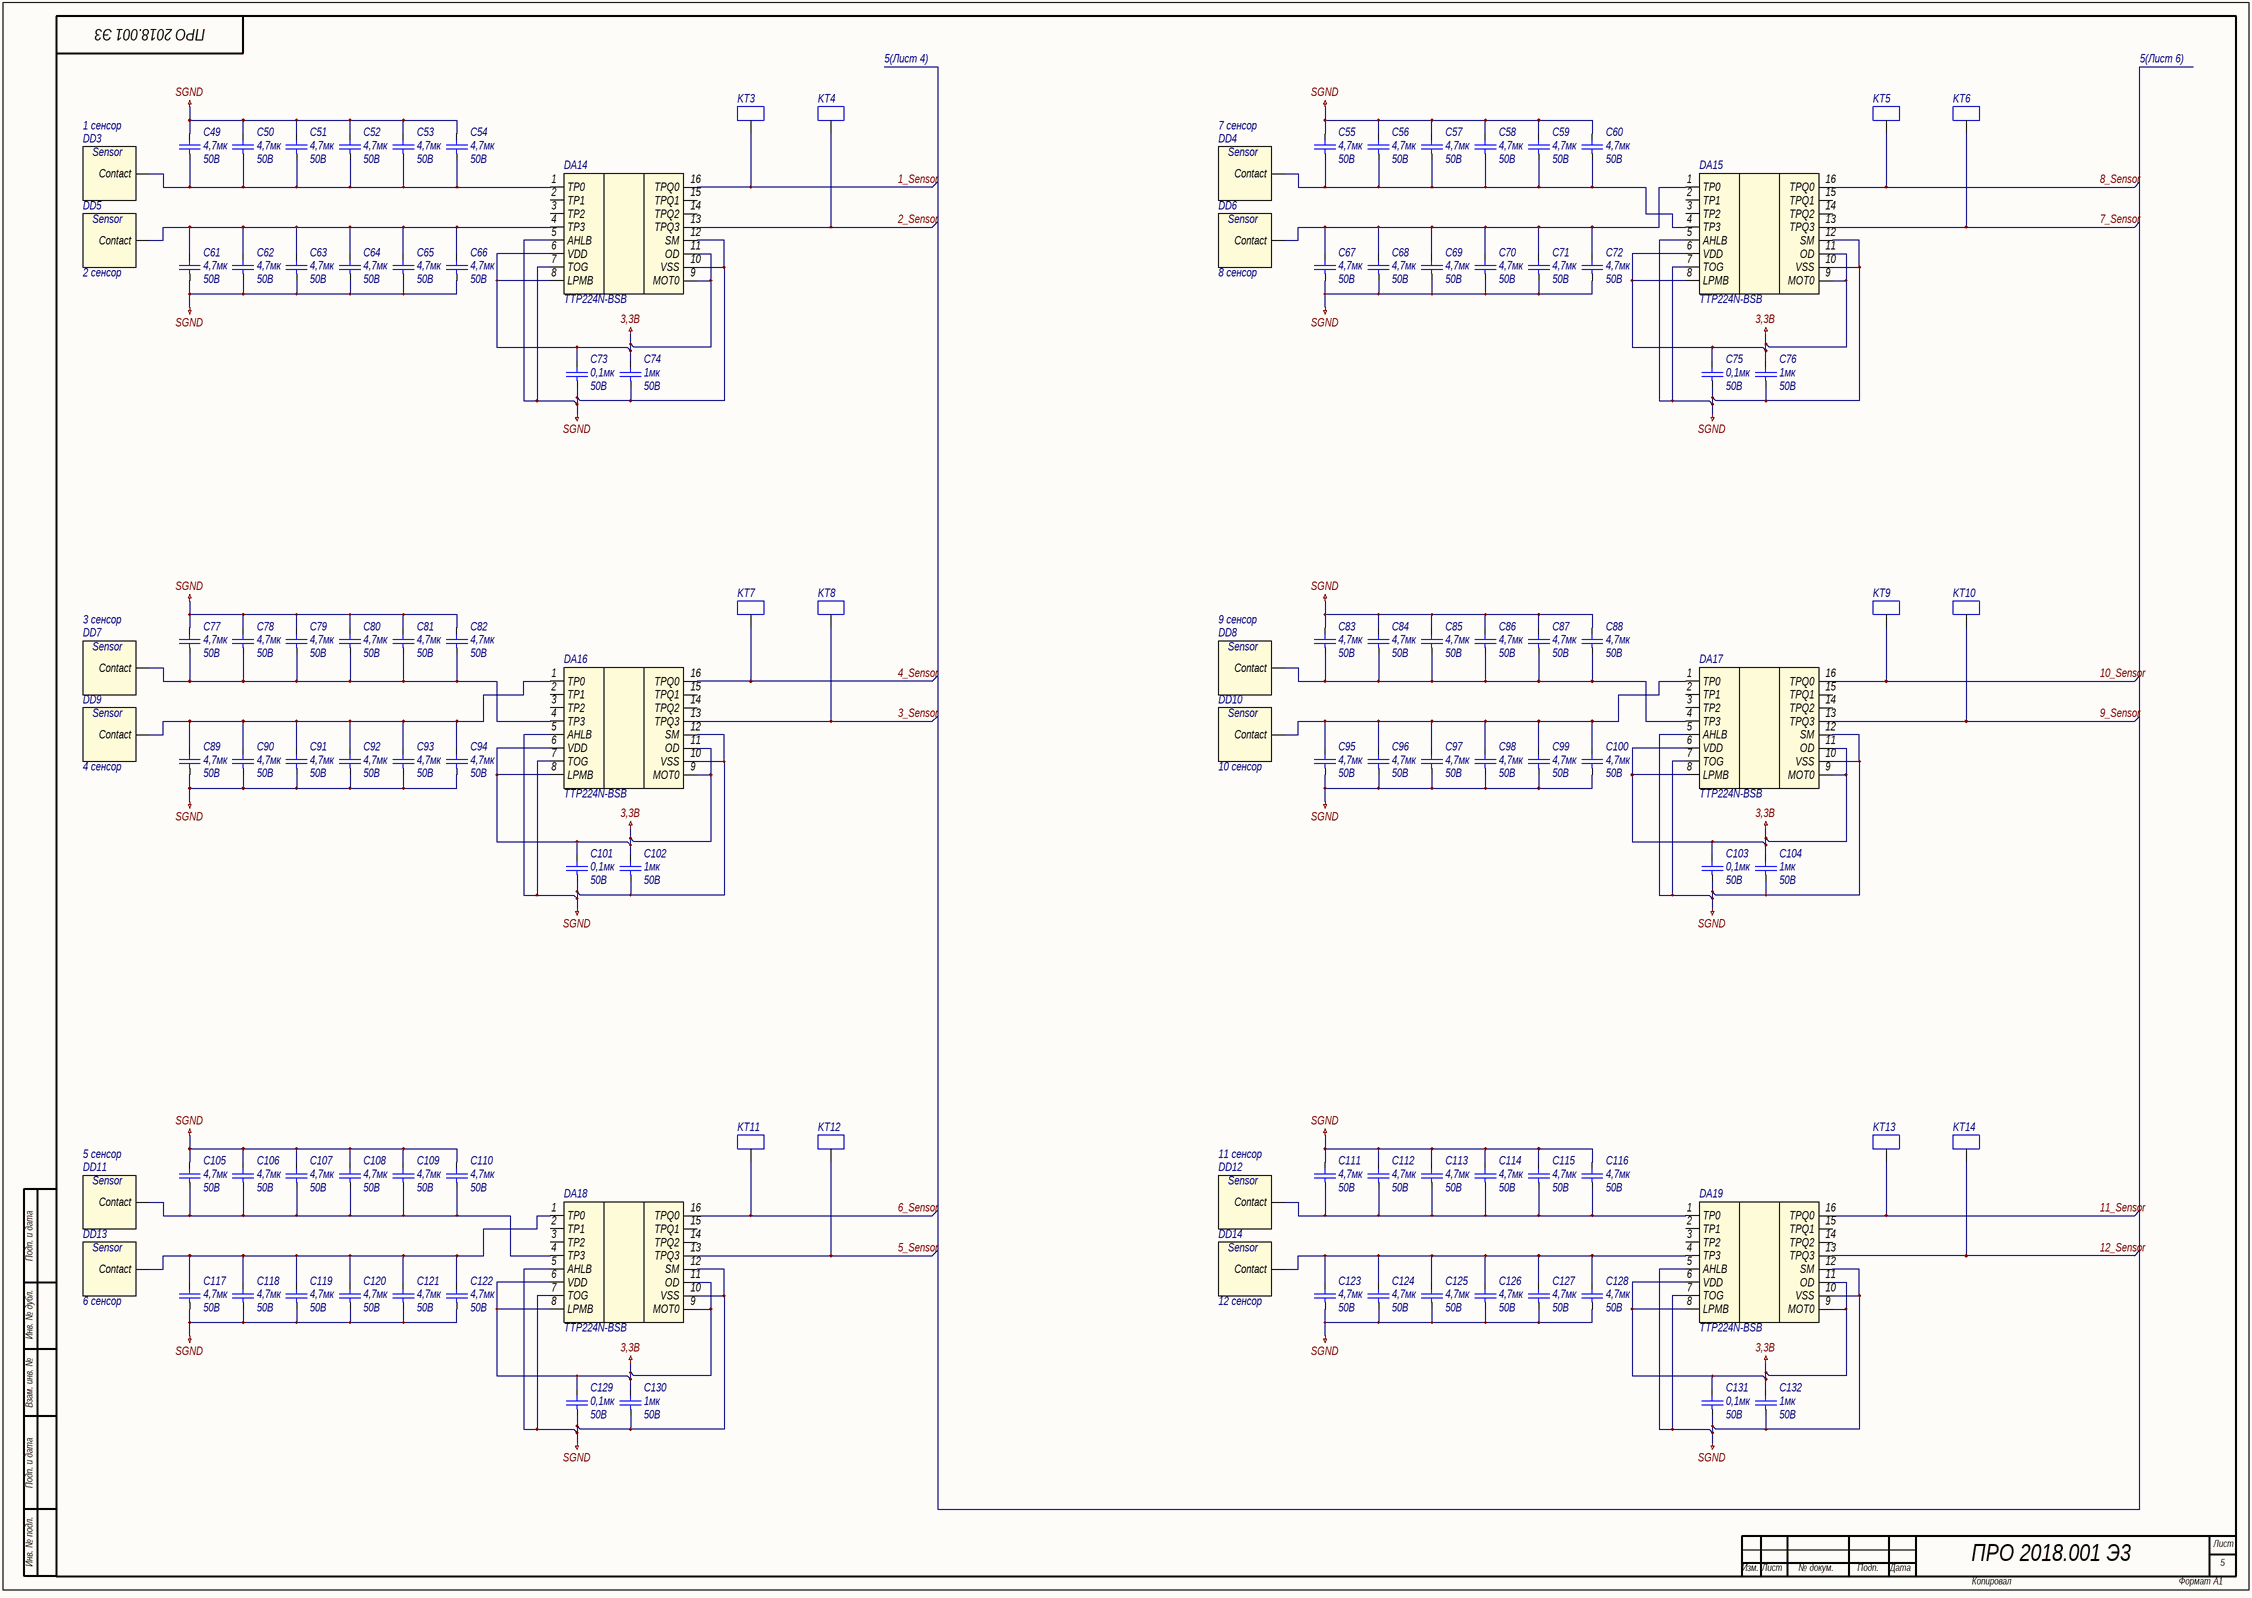
[diagram p5: Trepanat_Sensors_2.SchDoc]

### Parts
C49  4,7мк  Voltage: 50В  [C0805]
C50  4,7мк  Voltage: 50В  [C0805]
C51  4,7мк  Voltage: 50В  [C0805]
C52  4,7мк  Voltage: 50В  [C0805]
C53  4,7мк  Voltage: 50В  [C0805]
C54  4,7мк  Voltage: 50В  [C0805]
C55  4,7мк  Voltage: 50В  [C0805]
C56  4,7мк  Voltage: 50В  [C0805]
C57  4,7мк  Voltage: 50В  [C0805]
C58  4,7мк  Voltage: 50В  [C0805]
C59  4,7мк  Voltage: 50В  [C0805]
C60  4,7мк  Voltage: 50В  [C0805]
C61  4,7мк  Voltage: 50В  [C0805]
C62  4,7мк  Voltage: 50В  [C0805]
C63  4,7мк  Voltage: 50В  [C0805]
C64  4,7мк  Voltage: 50В  [C0805]
C65  4,7мк  Voltage: 50В  [C0805]
C66  4,7мк  Voltage: 50В  [C0805]
C67  4,7мк  Voltage: 50В  [C0805]
C68  4,7мк  Voltage: 50В  [C0805]
C69  4,7мк  Voltage: 50В  [C0805]
C70  4,7мк  Voltage: 50В  [C0805]
C71  4,7мк  Voltage: 50В  [C0805]
C72  4,7мк  Voltage: 50В  [C0805]
C73  0,1мк  Voltage: 50В  [C0805]
C74  1мк  Voltage: 50В  [C0805]
C75  0,1мк  Voltage: 50В  [C0805]
C76  1мк  Voltage: 50В  [C0805]
C77  4,7мк  Voltage: 50В  [C0805]
C78  4,7мк  Voltage: 50В  [C0805]
C79  4,7мк  Voltage: 50В  [C0805]
C80  4,7мк  Voltage: 50В  [C0805]
C81  4,7мк  Voltage: 50В  [C0805]
C82  4,7мк  Voltage: 50В  [C0805]
C83  4,7мк  Voltage: 50В  [C0805]
C84  4,7мк  Voltage: 50В  [C0805]
C85  4,7мк  Voltage: 50В  [C0805]
C86  4,7мк  Voltage: 50В  [C0805]
C87  4,7мк  Voltage: 50В  [C0805]
C88  4,7мк  Voltage: 50В  [C0805]
C89  4,7мк  Voltage: 50В  [C0805]
C90  4,7мк  Voltage: 50В  [C0805]
C91  4,7мк  Voltage: 50В  [C0805]
C92  4,7мк  Voltage: 50В  [C0805]
C93  4,7мк  Voltage: 50В  [C0805]
C94  4,7мк  Voltage: 50В  [C0805]
C95  4,7мк  Voltage: 50В  [C0805]
C96  4,7мк  Voltage: 50В  [C0805]
C97  4,7мк  Voltage: 50В  [C0805]
C98  4,7мк  Voltage: 50В  [C0805]
C99  4,7мк  Voltage: 50В  [C0805]
C100  4,7мк  Voltage: 50В  [C0805]
C101  0,1мк  Voltage: 50В  [C0805]
C102  1мк  Voltage: 50В  [C0805]
C103  0,1мк  Voltage: 50В  [C0805]
C104  1мк  Voltage: 50В  [C0805]
C105  4,7мк  Voltage: 50В  [C0805]
C106  4,7мк  Voltage: 50В  [C0805]
C107  4,7мк  Voltage: 50В  [C0805]
C108  4,7мк  Voltage: 50В  [C0805]
C109  4,7мк  Voltage: 50В  [C0805]
C110  4,7мк  Voltage: 50В  [C0805]
C111  4,7мк  Voltage: 50В  [C0805]
C112  4,7мк  Voltage: 50В  [C0805]
C113  4,7мк  Voltage: 50В  [C0805]
C114  4,7мк  Voltage: 50В  [C0805]
C115  4,7мк  Voltage: 50В  [C0805]
C116  4,7мк  Voltage: 50В  [C0805]
C117  4,7мк  Voltage: 50В  [C0805]
C118  4,7мк  Voltage: 50В  [C0805]
C119  4,7мк  Voltage: 50В  [C0805]
C120  4,7мк  Voltage: 50В  [C0805]
C121  4,7мк  Voltage: 50В  [C0805]
C122  4,7мк  Voltage: 50В  [C0805]
C123  4,7мк  Voltage: 50В  [C0805]
C124  4,7мк  Voltage: 50В  [C0805]
C125  4,7мк  Voltage: 50В  [C0805]
C126  4,7мк  Voltage: 50В  [C0805]
C127  4,7мк  Voltage: 50В  [C0805]
C128  4,7мк  Voltage: 50В  [C0805]
C129  0,1мк  Voltage: 50В  [C0805]
C130  1мк  Voltage: 50В  [C0805]
C131  0,1мк  Voltage: 50В  [C0805]
C132  1мк  Voltage: 50В  [C0805]
DA14  TTP224N-BSB  [SSOP16]
DA15  TTP224N-BSB  [SSOP16]
DA16  TTP224N-BSB  [SSOP16]
DA17  TTP224N-BSB  [SSOP16]
DA18  TTP224N-BSB  [SSOP16]
DA19  TTP224N-BSB  [SSOP16]
DD3  1 сенсор  [SENSOR]
DD4  7 сенсор  [SENSOR]
DD5  2 сенсор  [SENSOR]
DD6  8 сенсор  [SENSOR]
DD7  3 сенсор  [SENSOR]
DD8  9 сенсор  [SENSOR]
DD9  4 сенсор  [SENSOR]
DD10  10 сенсор  [SENSOR]
DD11  5 сенсор  [SENSOR]
DD12  11 сенсор  [SENSOR]
DD13  6 сенсор  [SENSOR]
DD14  12 сенсор  [SENSOR]
KT3  KT  [КТ]  (value not drawn)
KT4  KT  [КТ]  (value not drawn)
KT5  KT  [КТ]  (value not drawn)
KT6  KT  [КТ]  (value not drawn)
KT7  KT  [КТ]  (value not drawn)
KT8  KT  [КТ]  (value not drawn)
KT9  KT  [КТ]  (value not drawn)
KT10  KT  [КТ]  (value not drawn)
KT11  KT  [КТ]  (value not drawn)
KT12  KT  [КТ]  (value not drawn)
KT13  KT  [КТ]  (value not drawn)
KT14  KT  [КТ]  (value not drawn)

### Nets
3,3B: C73.2 C74.2 C75.2 C76.2 C101.2 C102.2 C103.2 C104.2 C129.2 C130.2 C131.2 C132.2 DA14.6(VDD) DA14.8(LPMB) DA14.9(MOT0) DA14.11(OD) DA15.6(VDD) DA15.8(LPMB) DA15.9(MOT0) DA15.11(OD) DA16.6(VDD) DA16.8(LPMB) DA16.9(MOT0) DA16.11(OD) DA17.6(VDD) DA17.8(LPMB) DA17.9(MOT0) DA17.11(OD) DA18.6(VDD) DA18.8(LPMB) DA18.9(MOT0) DA18.11(OD) DA19.6(VDD) DA19.8(LPMB) DA19.9(MOT0) DA19.11(OD)
SGND: C49.2 C50.2 C51.2 C52.2 C53.2 C54.2 C55.2 C56.2 C57.2 C58.2 C59.2 C60.2 C61.1 C62.1 C63.1 C64.1 C65.1 C66.1 C67.1 C68.1 C69.1 C70.1 C71.1 C72.1 C73.1 C74.1 C75.1 C76.1 C77.2 C78.2 C79.2 C80.2 C81.2 C82.2 C83.2 C84.2 C85.2 C86.2 C87.2 C88.2 C89.1 C90.1 C91.1 C92.1 C93.1 C94.1 C95.1 C96.1 C97.1 C98.1 C99.1 C100.1 C101.1 C102.1 C103.1 C104.1 C105.2 C106.2 C107.2 C108.2 C109.2 C110.2 C111.2 C112.2 C113.2 C114.2 C115.2 C116.2 C117.1 C118.1 C119.1 C120.1 C121.1 C122.1 C123.1 C124.1 C125.1 C126.1 C127.1 C128.1 C129.1 C130.1 C131.1 C132.1 DA14.5(AHLB) DA14.7(TOG) DA14.10(VSS) DA14.12(SM) DA15.5(AHLB) DA15.7(TOG) DA15.10(VSS) DA15.12(SM) DA16.5(AHLB) DA16.7(TOG) DA16.10(VSS) DA16.12(SM) DA17.5(AHLB) DA17.7(TOG) DA17.10(VSS) DA17.12(SM) DA18.5(AHLB) DA18.7(TOG) DA18.10(VSS) DA18.12(SM) DA19.5(AHLB) DA19.7(TOG) DA19.10(VSS) DA19.12(SM)
1_Sensor: DA14.16(TPQ0) KT3.1
2_Sensor: DA14.13(TPQ3) KT4.1
3_Sensor: DA16.13(TPQ3) KT8.1
4_Sensor: DA16.16(TPQ0) KT7.1
5_Sensor: DA18.13(TPQ3) KT12.1
6_Sensor: DA18.16(TPQ0) KT11.1
7_Sensor: DA15.13(TPQ3) KT6.1
8_Sensor: DA15.16(TPQ0) KT5.1
9_Sensor: DA17.13(TPQ3) KT10.1
10_Sensor: DA17.16(TPQ0) KT9.1
11_Sensor: DA19.16(TPQ0) KT13.1
12_Sensor: DA19.13(TPQ3) KT14.1
NetC49_1: C49.1 C50.1 C51.1 C52.1 C53.1 C54.1 DA14.1(TP0) DD3.1(Contact)
NetC55_1: C55.1 C56.1 C57.1 C58.1 C59.1 C60.1 DA15.4(TP3) DD4.1(Contact)
NetC61_2: C61.2 C62.2 C63.2 C64.2 C65.2 C66.2 DA14.4(TP3) DD5.1(Contact)
NetC67_2: C67.2 C68.2 C69.2 C70.2 C71.2 C72.2 DA15.1(TP0) DD6.1(Contact)
NetC77_1: C77.1 C78.1 C79.1 C80.1 C81.1 C82.1 DA16.4(TP3) DD7.1(Contact)
NetC83_1: C83.1 C84.1 C85.1 C86.1 C87.1 C88.1 DA17.4(TP3) DD8.1(Contact)
NetC89_2: C89.2 C90.2 C91.2 C92.2 C93.2 C94.2 DA16.1(TP0) DD9.1(Contact)
NetC95_2: C95.2 C96.2 C97.2 C98.2 C99.2 C100.2 DA17.1(TP0) DD10.1(Contact)
NetC105_1: C105.1 C106.1 C107.1 C108.1 C109.1 C110.1 DA18.4(TP3) DD11.1(Contact)
NetC111_1: C111.1 C112.1 C113.1 C114.1 C115.1 C116.1 DA19.1(TP0) DD12.1(Contact)
NetC117_2: C117.2 C118.2 C119.2 C120.2 C121.2 C122.2 DA18.1(TP0) DD13.1(Contact)
NetC123_2: C123.2 C124.2 C125.2 C126.2 C127.2 C128.2 DA19.4(TP3) DD14.1(Contact)

Not connected (* = marked no-connect by the designer): DA14 2(TP1) 3(TP2) 14(TPQ2) 15(TPQ1); DA15 2(TP1) 3(TP2) 14(TPQ2) 15(TPQ1); DA16 2(TP1) 3(TP2) 14(TPQ2) 15(TPQ1); DA17 2(TP1) 3(TP2) 14(TPQ2) 15(TPQ1); DA18 2(TP1) 3(TP2) 14(TPQ2) 15(TPQ1); DA19 2(TP1) 3(TP2) 14(TPQ2) 15(TPQ1)

### Notes on the sheet
- 5(Лист 4)
- 5(Лист 6)
- Подп. и дата
- Инв. № дубл.
- Взам. инв. №
- Инв. № подл.
- Лист
- Изм.
- № докум.
- Подп.
- Дата
- Копировал
- Формат

### Library data of the parts
C49-C132 = Capacitor: Конденсатор
  C49-C72 C77-C100 C105-C128: Value: 4,7мк
  C73 C75 C101 C103 C129 C131: Value: 0,1мк
  C74 C76 C102 C104 C130 C132: Value: 1мк
DA14-DA19 = TTP224N-BSB: 4 keys Touch Pad Detector IC; Name: TTP224N-BSB
DD3-DD14 = Sensor: Сенсорная площадка
  DD3: Name: 1 сенсор
  DD4: Name: 7 сенсор
  DD5: Name: 2 сенсор
  DD6: Name: 8 сенсор
  DD7: Name: 3 сенсор
  DD8: Name: 9 сенсор
  DD9: Name: 4 сенсор
  DD10: Name: 10 сенсор
  DD11: Name: 5 сенсор
  DD12: Name: 11 сенсор
  DD13: Name: 6 сенсор
  DD14: Name: 12 сенсор
KT3-KT14 = KT: Контрольная точка

## Sheet Trepanat_Sensors_3.SchDoc
size 840 x 594 mm; DocumentNumber: ПРО 2018.001 Э3; SheetNumber: 6; Format: A1
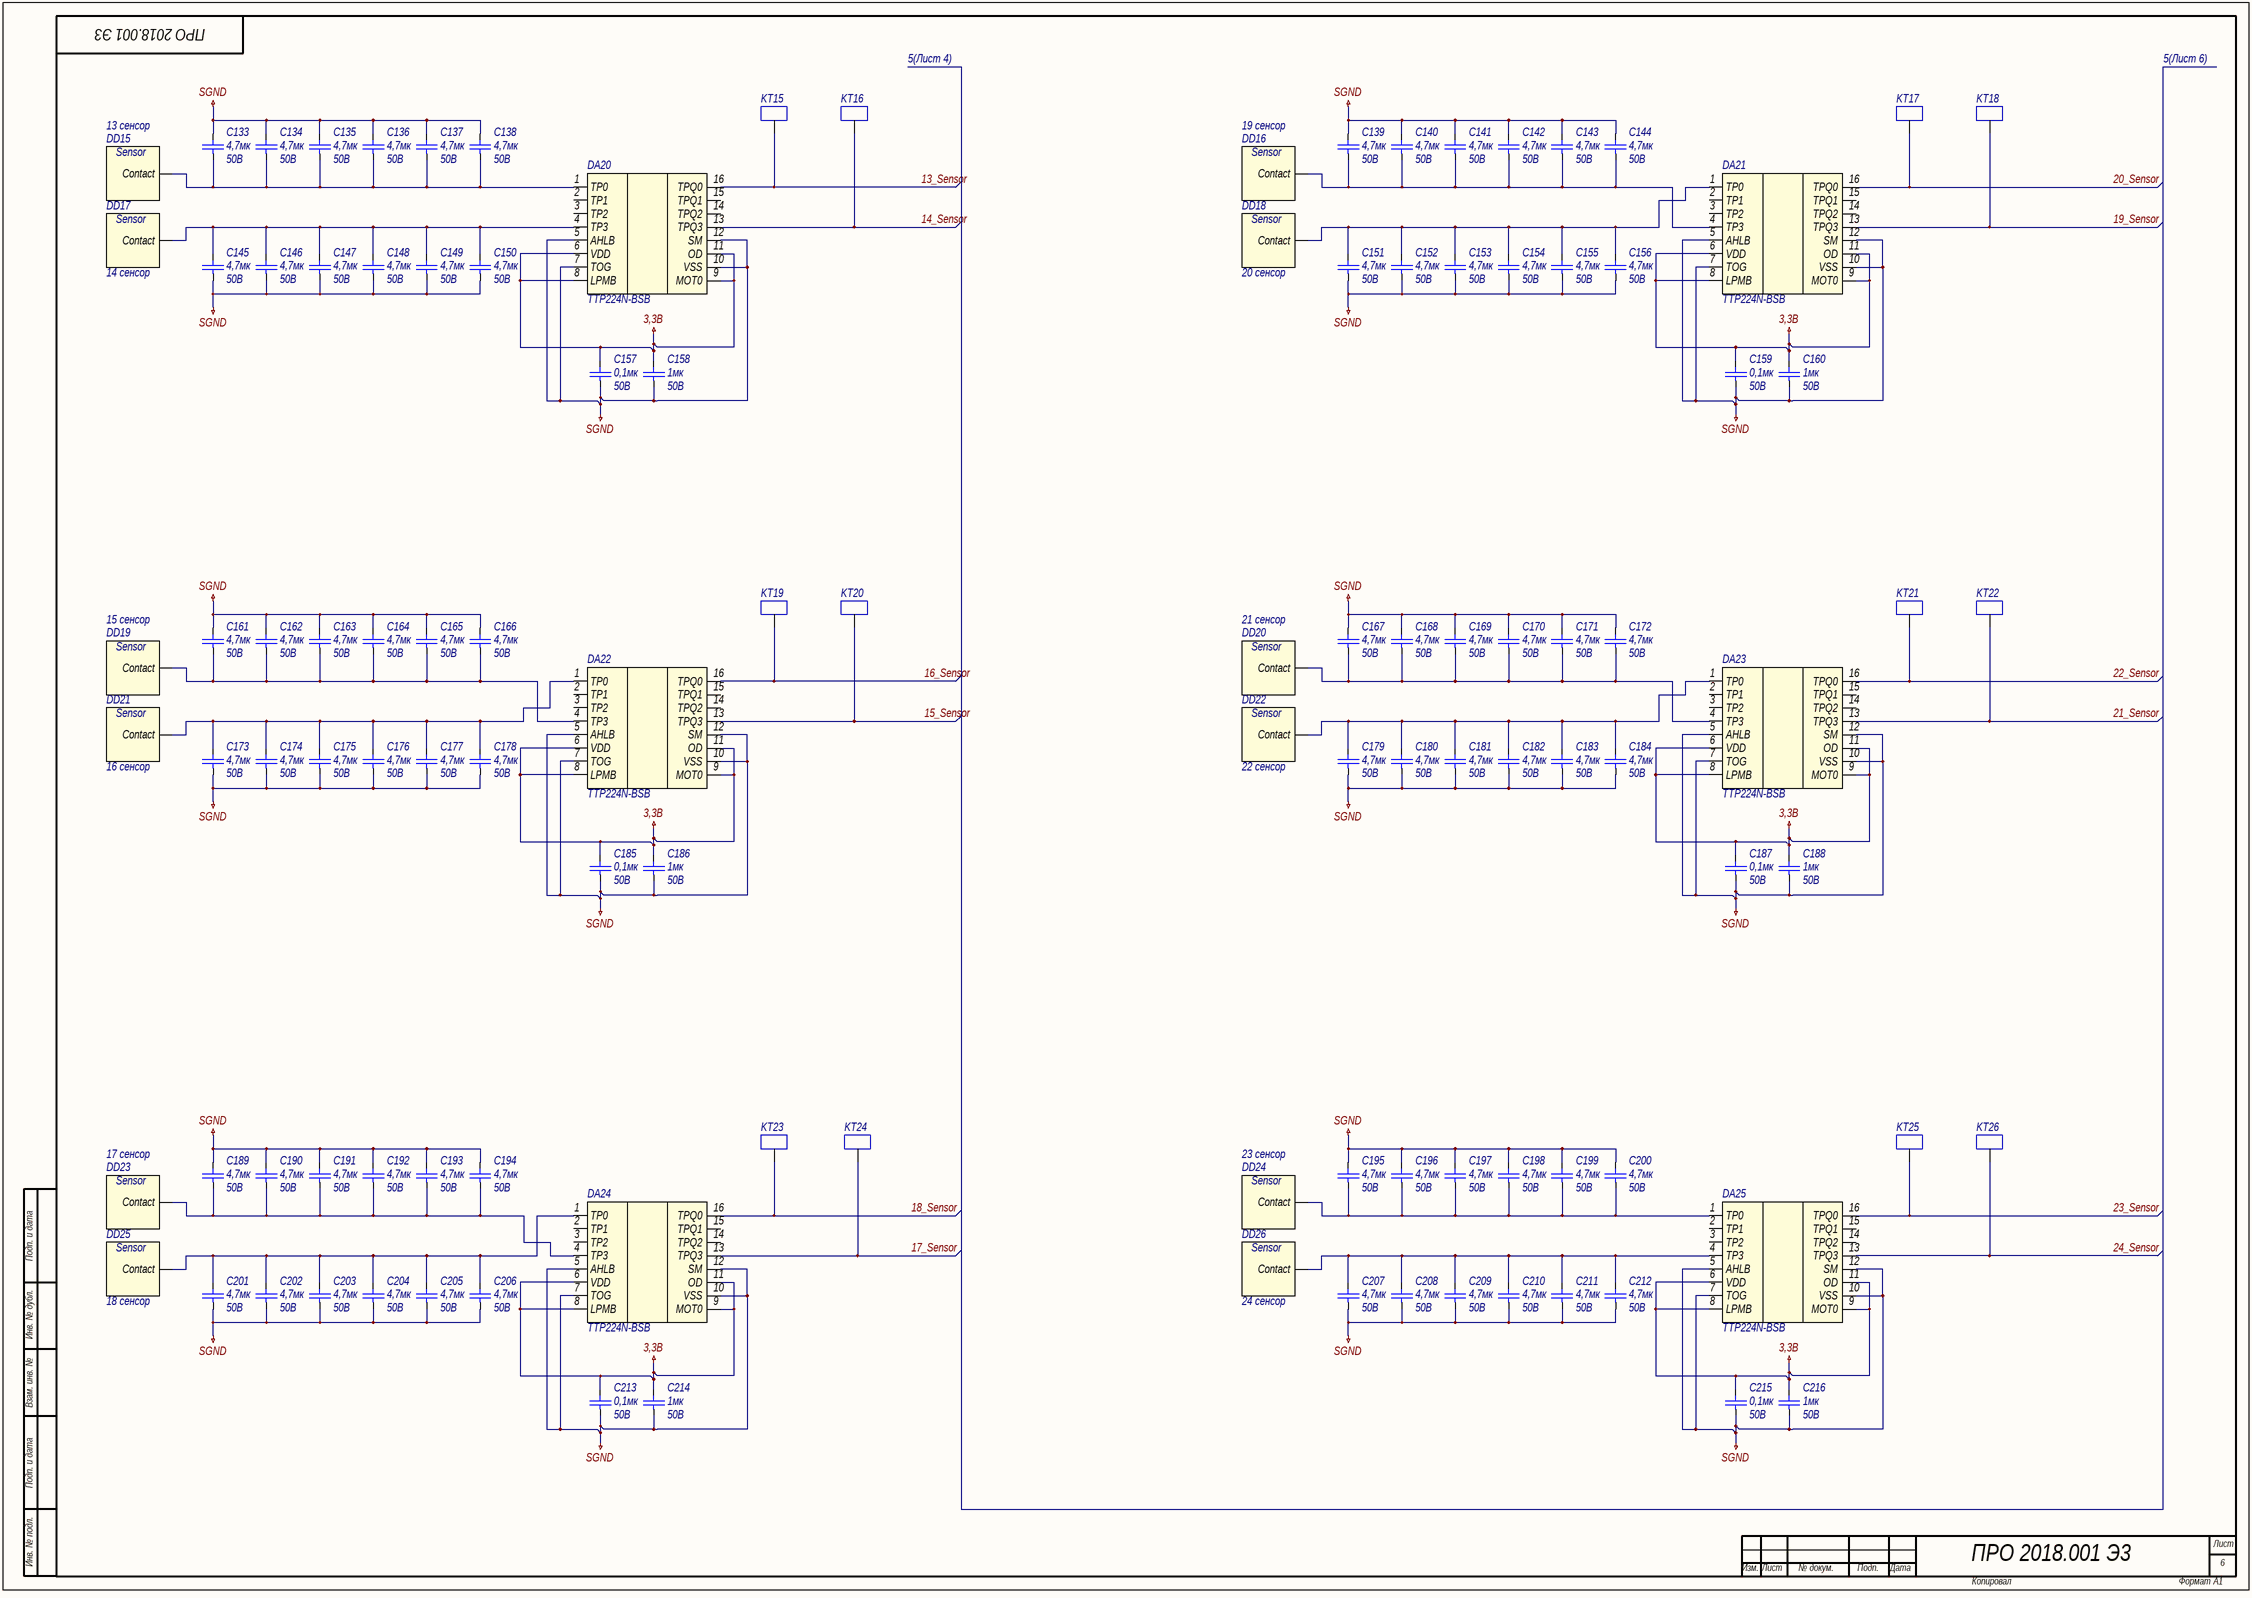
[diagram p6: Trepanat_Sensors_3.SchDoc]

### Parts
C133  4,7мк  Voltage: 50В  [C0805]
C134  4,7мк  Voltage: 50В  [C0805]
C135  4,7мк  Voltage: 50В  [C0805]
C136  4,7мк  Voltage: 50В  [C0805]
C137  4,7мк  Voltage: 50В  [C0805]
C138  4,7мк  Voltage: 50В  [C0805]
C139  4,7мк  Voltage: 50В  [C0805]
C140  4,7мк  Voltage: 50В  [C0805]
C141  4,7мк  Voltage: 50В  [C0805]
C142  4,7мк  Voltage: 50В  [C0805]
C143  4,7мк  Voltage: 50В  [C0805]
C144  4,7мк  Voltage: 50В  [C0805]
C145  4,7мк  Voltage: 50В  [C0805]
C146  4,7мк  Voltage: 50В  [C0805]
C147  4,7мк  Voltage: 50В  [C0805]
C148  4,7мк  Voltage: 50В  [C0805]
C149  4,7мк  Voltage: 50В  [C0805]
C150  4,7мк  Voltage: 50В  [C0805]
C151  4,7мк  Voltage: 50В  [C0805]
C152  4,7мк  Voltage: 50В  [C0805]
C153  4,7мк  Voltage: 50В  [C0805]
C154  4,7мк  Voltage: 50В  [C0805]
C155  4,7мк  Voltage: 50В  [C0805]
C156  4,7мк  Voltage: 50В  [C0805]
C157  0,1мк  Voltage: 50В  [C0805]
C158  1мк  Voltage: 50В  [C0805]
C159  0,1мк  Voltage: 50В  [C0805]
C160  1мк  Voltage: 50В  [C0805]
C161  4,7мк  Voltage: 50В  [C0805]
C162  4,7мк  Voltage: 50В  [C0805]
C163  4,7мк  Voltage: 50В  [C0805]
C164  4,7мк  Voltage: 50В  [C0805]
C165  4,7мк  Voltage: 50В  [C0805]
C166  4,7мк  Voltage: 50В  [C0805]
C167  4,7мк  Voltage: 50В  [C0805]
C168  4,7мк  Voltage: 50В  [C0805]
C169  4,7мк  Voltage: 50В  [C0805]
C170  4,7мк  Voltage: 50В  [C0805]
C171  4,7мк  Voltage: 50В  [C0805]
C172  4,7мк  Voltage: 50В  [C0805]
C173  4,7мк  Voltage: 50В  [C0805]
C174  4,7мк  Voltage: 50В  [C0805]
C175  4,7мк  Voltage: 50В  [C0805]
C176  4,7мк  Voltage: 50В  [C0805]
C177  4,7мк  Voltage: 50В  [C0805]
C178  4,7мк  Voltage: 50В  [C0805]
C179  4,7мк  Voltage: 50В  [C0805]
C180  4,7мк  Voltage: 50В  [C0805]
C181  4,7мк  Voltage: 50В  [C0805]
C182  4,7мк  Voltage: 50В  [C0805]
C183  4,7мк  Voltage: 50В  [C0805]
C184  4,7мк  Voltage: 50В  [C0805]
C185  0,1мк  Voltage: 50В  [C0805]
C186  1мк  Voltage: 50В  [C0805]
C187  0,1мк  Voltage: 50В  [C0805]
C188  1мк  Voltage: 50В  [C0805]
C189  4,7мк  Voltage: 50В  [C0805]
C190  4,7мк  Voltage: 50В  [C0805]
C191  4,7мк  Voltage: 50В  [C0805]
C192  4,7мк  Voltage: 50В  [C0805]
C193  4,7мк  Voltage: 50В  [C0805]
C194  4,7мк  Voltage: 50В  [C0805]
C195  4,7мк  Voltage: 50В  [C0805]
C196  4,7мк  Voltage: 50В  [C0805]
C197  4,7мк  Voltage: 50В  [C0805]
C198  4,7мк  Voltage: 50В  [C0805]
C199  4,7мк  Voltage: 50В  [C0805]
C200  4,7мк  Voltage: 50В  [C0805]
C201  4,7мк  Voltage: 50В  [C0805]
C202  4,7мк  Voltage: 50В  [C0805]
C203  4,7мк  Voltage: 50В  [C0805]
C204  4,7мк  Voltage: 50В  [C0805]
C205  4,7мк  Voltage: 50В  [C0805]
C206  4,7мк  Voltage: 50В  [C0805]
C207  4,7мк  Voltage: 50В  [C0805]
C208  4,7мк  Voltage: 50В  [C0805]
C209  4,7мк  Voltage: 50В  [C0805]
C210  4,7мк  Voltage: 50В  [C0805]
C211  4,7мк  Voltage: 50В  [C0805]
C212  4,7мк  Voltage: 50В  [C0805]
C213  0,1мк  Voltage: 50В  [C0805]
C214  1мк  Voltage: 50В  [C0805]
C215  0,1мк  Voltage: 50В  [C0805]
C216  1мк  Voltage: 50В  [C0805]
DA20  TTP224N-BSB  [SSOP16]
DA21  TTP224N-BSB  [SSOP16]
DA22  TTP224N-BSB  [SSOP16]
DA23  TTP224N-BSB  [SSOP16]
DA24  TTP224N-BSB  [SSOP16]
DA25  TTP224N-BSB  [SSOP16]
DD15  13 сенсор  [SENSOR]
DD16  19 сенсор  [SENSOR]
DD17  14 сенсор  [SENSOR]
DD18  20 сенсор  [SENSOR]
DD19  15 сенсор  [SENSOR]
DD20  21 сенсор  [SENSOR]
DD21  16 сенсор  [SENSOR]
DD22  22 сенсор  [SENSOR]
DD23  17 сенсор  [SENSOR]
DD24  23 сенсор  [SENSOR]
DD25  18 сенсор  [SENSOR]
DD26  24 сенсор  [SENSOR]
KT15  KT  [КТ]  (value not drawn)
KT16  KT  [КТ]  (value not drawn)
KT17  KT  [КТ]  (value not drawn)
KT18  KT  [КТ]  (value not drawn)
KT19  KT  [КТ]  (value not drawn)
KT20  KT  [КТ]  (value not drawn)
KT21  KT  [КТ]  (value not drawn)
KT22  KT  [КТ]  (value not drawn)
KT23  KT  [КТ]  (value not drawn)
KT24  KT  [КТ]  (value not drawn)
KT25  KT  [КТ]  (value not drawn)
KT26  KT  [КТ]  (value not drawn)

### Nets
3,3B: C157.2 C158.2 C159.2 C160.2 C185.2 C186.2 C187.2 C188.2 C213.2 C214.2 C215.2 C216.2 DA20.6(VDD) DA20.8(LPMB) DA20.9(MOT0) DA20.11(OD) DA21.6(VDD) DA21.8(LPMB) DA21.9(MOT0) DA21.11(OD) DA22.6(VDD) DA22.8(LPMB) DA22.9(MOT0) DA22.11(OD) DA23.6(VDD) DA23.8(LPMB) DA23.9(MOT0) DA23.11(OD) DA24.6(VDD) DA24.8(LPMB) DA24.9(MOT0) DA24.11(OD) DA25.6(VDD) DA25.8(LPMB) DA25.9(MOT0) DA25.11(OD)
SGND: C133.2 C134.2 C135.2 C136.2 C137.2 C138.2 C139.2 C140.2 C141.2 C142.2 C143.2 C144.2 C145.1 C146.1 C147.1 C148.1 C149.1 C150.1 C151.1 C152.1 C153.1 C154.1 C155.1 C156.1 C157.1 C158.1 C159.1 C160.1 C161.2 C162.2 C163.2 C164.2 C165.2 C166.2 C167.2 C168.2 C169.2 C170.2 C171.2 C172.2 C173.1 C174.1 C175.1 C176.1 C177.1 C178.1 C179.1 C180.1 C181.1 C182.1 C183.1 C184.1 C185.1 C186.1 C187.1 C188.1 C189.2 C190.2 C191.2 C192.2 C193.2 C194.2 C195.2 C196.2 C197.2 C198.2 C199.2 C200.2 C201.1 C202.1 C203.1 C204.1 C205.1 C206.1 C207.1 C208.1 C209.1 C210.1 C211.1 C212.1 C213.1 C214.1 C215.1 C216.1 DA20.5(AHLB) DA20.7(TOG) DA20.10(VSS) DA20.12(SM) DA21.5(AHLB) DA21.7(TOG) DA21.10(VSS) DA21.12(SM) DA22.5(AHLB) DA22.7(TOG) DA22.10(VSS) DA22.12(SM) DA23.5(AHLB) DA23.7(TOG) DA23.10(VSS) DA23.12(SM) DA24.5(AHLB) DA24.7(TOG) DA24.10(VSS) DA24.12(SM) DA25.5(AHLB) DA25.7(TOG) DA25.10(VSS) DA25.12(SM)
13_Sensor: DA20.16(TPQ0) KT15.1
14_Sensor: DA20.13(TPQ3) KT16.1
15_Sensor: DA22.13(TPQ3) KT20.1
16_Sensor: DA22.16(TPQ0) KT19.1
17_Sensor: DA24.13(TPQ3) KT24.1
18_Sensor: DA24.16(TPQ0) KT23.1
19_Sensor: DA21.13(TPQ3) KT18.1
20_Sensor: DA21.16(TPQ0) KT17.1
21_Sensor: DA23.13(TPQ3) KT22.1
22_Sensor: DA23.16(TPQ0) KT21.1
23_Sensor: DA25.16(TPQ0) KT25.1
24_Sensor: DA25.13(TPQ3) KT26.1
NetC133_1: C133.1 C134.1 C135.1 C136.1 C137.1 C138.1 DA20.1(TP0) DD15.1(Contact)
NetC139_1: C139.1 C140.1 C141.1 C142.1 C143.1 C144.1 DA21.4(TP3) DD16.1(Contact)
NetC145_2: C145.2 C146.2 C147.2 C148.2 C149.2 C150.2 DA20.4(TP3) DD17.1(Contact)
NetC151_2: C151.2 C152.2 C153.2 C154.2 C155.2 C156.2 DA21.1(TP0) DD18.1(Contact)
NetC161_1: C161.1 C162.1 C163.1 C164.1 C165.1 C166.1 DA22.4(TP3) DD19.1(Contact)
NetC167_1: C167.1 C168.1 C169.1 C170.1 C171.1 C172.1 DA23.4(TP3) DD20.1(Contact)
NetC173_2: C173.2 C174.2 C175.2 C176.2 C177.2 C178.2 DA22.1(TP0) DD21.1(Contact)
NetC179_2: C179.2 C180.2 C181.2 C182.2 C183.2 C184.2 DA23.1(TP0) DD22.1(Contact)
NetC189_1: C189.1 C190.1 C191.1 C192.1 C193.1 C194.1 DA24.4(TP3) DD23.1(Contact)
NetC195_1: C195.1 C196.1 C197.1 C198.1 C199.1 C200.1 DA25.1(TP0) DD24.1(Contact)
NetC201_2: C201.2 C202.2 C203.2 C204.2 C205.2 C206.2 DA24.1(TP0) DD25.1(Contact)
NetC207_2: C207.2 C208.2 C209.2 C210.2 C211.2 C212.2 DA25.4(TP3) DD26.1(Contact)

Not connected (* = marked no-connect by the designer): DA20 2(TP1) 3(TP2) 14(TPQ2) 15(TPQ1); DA21 2(TP1) 3(TP2) 14(TPQ2) 15(TPQ1); DA22 2(TP1) 3(TP2) 14(TPQ2) 15(TPQ1); DA23 2(TP1) 3(TP2) 14(TPQ2) 15(TPQ1); DA24 2(TP1) 3(TP2) 14(TPQ2) 15(TPQ1); DA25 2(TP1) 3(TP2) 14(TPQ2) 15(TPQ1)

### Notes on the sheet
- 5(Лист 4)
- 5(Лист 6)
- Подп. и дата
- Инв. № дубл.
- Взам. инв. №
- Инв. № подл.
- Лист
- Изм.
- № докум.
- Подп.
- Дата
- Копировал
- Формат

### Library data of the parts
C133-C216 = Capacitor: Конденсатор
  C133-C156 C161-C184 C189-C212: Value: 4,7мк
  C157 C159 C185 C187 C213 C215: Value: 0,1мк
  C158 C160 C186 C188 C214 C216: Value: 1мк
DA20-DA25 = TTP224N-BSB: 4 keys Touch Pad Detector IC; Name: TTP224N-BSB
DD15-DD26 = Sensor: Сенсорная площадка
  DD15: Name: 13 сенсор
  DD16: Name: 19 сенсор
  DD17: Name: 14 сенсор
  DD18: Name: 20 сенсор
  DD19: Name: 15 сенсор
  DD20: Name: 21 сенсор
  DD21: Name: 16 сенсор
  DD22: Name: 22 сенсор
  DD23: Name: 17 сенсор
  DD24: Name: 23 сенсор
  DD25: Name: 18 сенсор
  DD26: Name: 24 сенсор
KT15-KT26 = KT: Контрольная точка

## Nets that join several sheets
3,3B: Trepanat_MCU (17 pins), Trepanat_Output (5 pins), Trepanat_Power (C28.1 DA3.3 KT2.1), Trepanat_Pressure (50 pins), Trepanat_Sensors_1 (20 pins), Trepanat_Sensors_2 (36 pins), Trepanat_Sensors_3 (36 pins)
SGND: Trepanat_MCU (24 pins), Trepanat_Output (9 pins), Trepanat_Power (13 pins), Trepanat_Pressure (40 pins), Trepanat_Sensors_1 (38 pins), Trepanat_Sensors_2 (108 pins), Trepanat_Sensors_3 (108 pins)
1_Sensor: Trepanat_MCU (DD1.98), Trepanat_Sensors_2 (DA14.16 KT3.1)
2_Sensor: Trepanat_MCU (DD1.1), Trepanat_Sensors_2 (DA14.13 KT4.1)
3_Sensor: Trepanat_MCU (DD1.3), Trepanat_Sensors_2 (DA16.13 KT8.1)
4_Sensor: Trepanat_MCU (DD1.2), Trepanat_Sensors_2 (DA16.16 KT7.1)
5_Sensor: Trepanat_MCU (DD1.5), Trepanat_Sensors_2 (DA18.13 KT12.1)
6_Sensor: Trepanat_MCU (DD1.4), Trepanat_Sensors_2 (DA18.16 KT11.1)
7_Sensor: Trepanat_MCU (DD1.16), Trepanat_Sensors_2 (DA15.13 KT6.1)
8_Sensor: Trepanat_MCU (DD1.15), Trepanat_Sensors_2 (DA15.16 KT5.1)
9_Sensor: Trepanat_MCU (DD1.18), Trepanat_Sensors_2 (DA17.13 KT10.1)
10_Sensor: Trepanat_MCU (DD1.17), Trepanat_Sensors_2 (DA17.16 KT9.1)
11_Sensor: Trepanat_MCU (DD1.23), Trepanat_Sensors_2 (DA19.16 KT13.1)
12_Sensor: Trepanat_MCU (DD1.24), Trepanat_Sensors_2 (DA19.13 KT14.1)
13_Sensor: Trepanat_MCU (DD1.51), Trepanat_Sensors_3 (DA20.16 KT15.1)
14_Sensor: Trepanat_MCU (DD1.52), Trepanat_Sensors_3 (DA20.13 KT16.1)
15_Sensor: Trepanat_MCU (DD1.54), Trepanat_Sensors_3 (DA22.13 KT20.1)
16_Sensor: Trepanat_MCU (DD1.53), Trepanat_Sensors_3 (DA22.16 KT19.1)
17_Sensor: Trepanat_MCU (DD1.56), Trepanat_Sensors_3 (DA24.13 KT24.1)
18_Sensor: Trepanat_MCU (DD1.55), Trepanat_Sensors_3 (DA24.16 KT23.1)
19_Sensor: Trepanat_MCU (DD1.60), Trepanat_Sensors_3 (DA21.13 KT18.1)
20_Sensor: Trepanat_MCU (DD1.59), Trepanat_Sensors_3 (DA21.16 KT17.1)
21_Sensor: Trepanat_MCU (DD1.58), Trepanat_Sensors_3 (DA23.13 KT22.1)
22_Sensor: Trepanat_MCU (DD1.57), Trepanat_Sensors_3 (DA23.16 KT21.1)
23_Sensor: Trepanat_MCU (DD1.61), Trepanat_Sensors_3 (DA25.16 KT25.1)
24_Sensor: Trepanat_MCU (DD1.62), Trepanat_Sensors_3 (DA25.13 KT26.1)
BMP280_CS1: Trepanat_MCU (DD1.38), Trepanat_Pressure (DA5.2 R17.2)
BMP280_CS2: Trepanat_MCU (DD1.36), Trepanat_Pressure (DA7.2 R19.2)
BMP280_CS3: Trepanat_MCU (DD1.35), Trepanat_Pressure (DA9.2 R21.2)
BMP280_CS4: Trepanat_MCU (DD1.34), Trepanat_Pressure (DA11.2 R23.2)
BMP280_CS5: Trepanat_MCU (DD1.33), Trepanat_Pressure (DA13.2 R25.2)
BMP280_CS6: Trepanat_MCU (DD1.39), Trepanat_Pressure (DA4.2 R16.2)
BMP280_CS7: Trepanat_MCU (DD1.40), Trepanat_Pressure (DA6.2 R18.2)
BMP280_CS8: Trepanat_MCU (DD1.41), Trepanat_Pressure (DA8.2 R20.2)
BMP280_CS9: Trepanat_MCU (DD1.42), Trepanat_Pressure (DA10.2 R22.2)
BMP280_CS10: Trepanat_MCU (DD1.43), Trepanat_Pressure (DA12.2 R24.2)
BMP280_MISO: Trepanat_MCU (DD1.31), Trepanat_Pressure (10 pins)
BMP280_MOSI: Trepanat_MCU (DD1.32), Trepanat_Pressure (10 pins)
BMP280_SCK: Trepanat_MCU (DD1.30), Trepanat_Pressure (10 pins)
MCU_UART1_RX: Trepanat_MCU (DD1.69), Trepanat_Output (R8.2 R10.1)
MCU_UART1_TX: Trepanat_MCU (DD1.68), Trepanat_Output (R9.2 R11.1)